# EAGLE board Hive 1.5 (EAGLE 9.6.2)
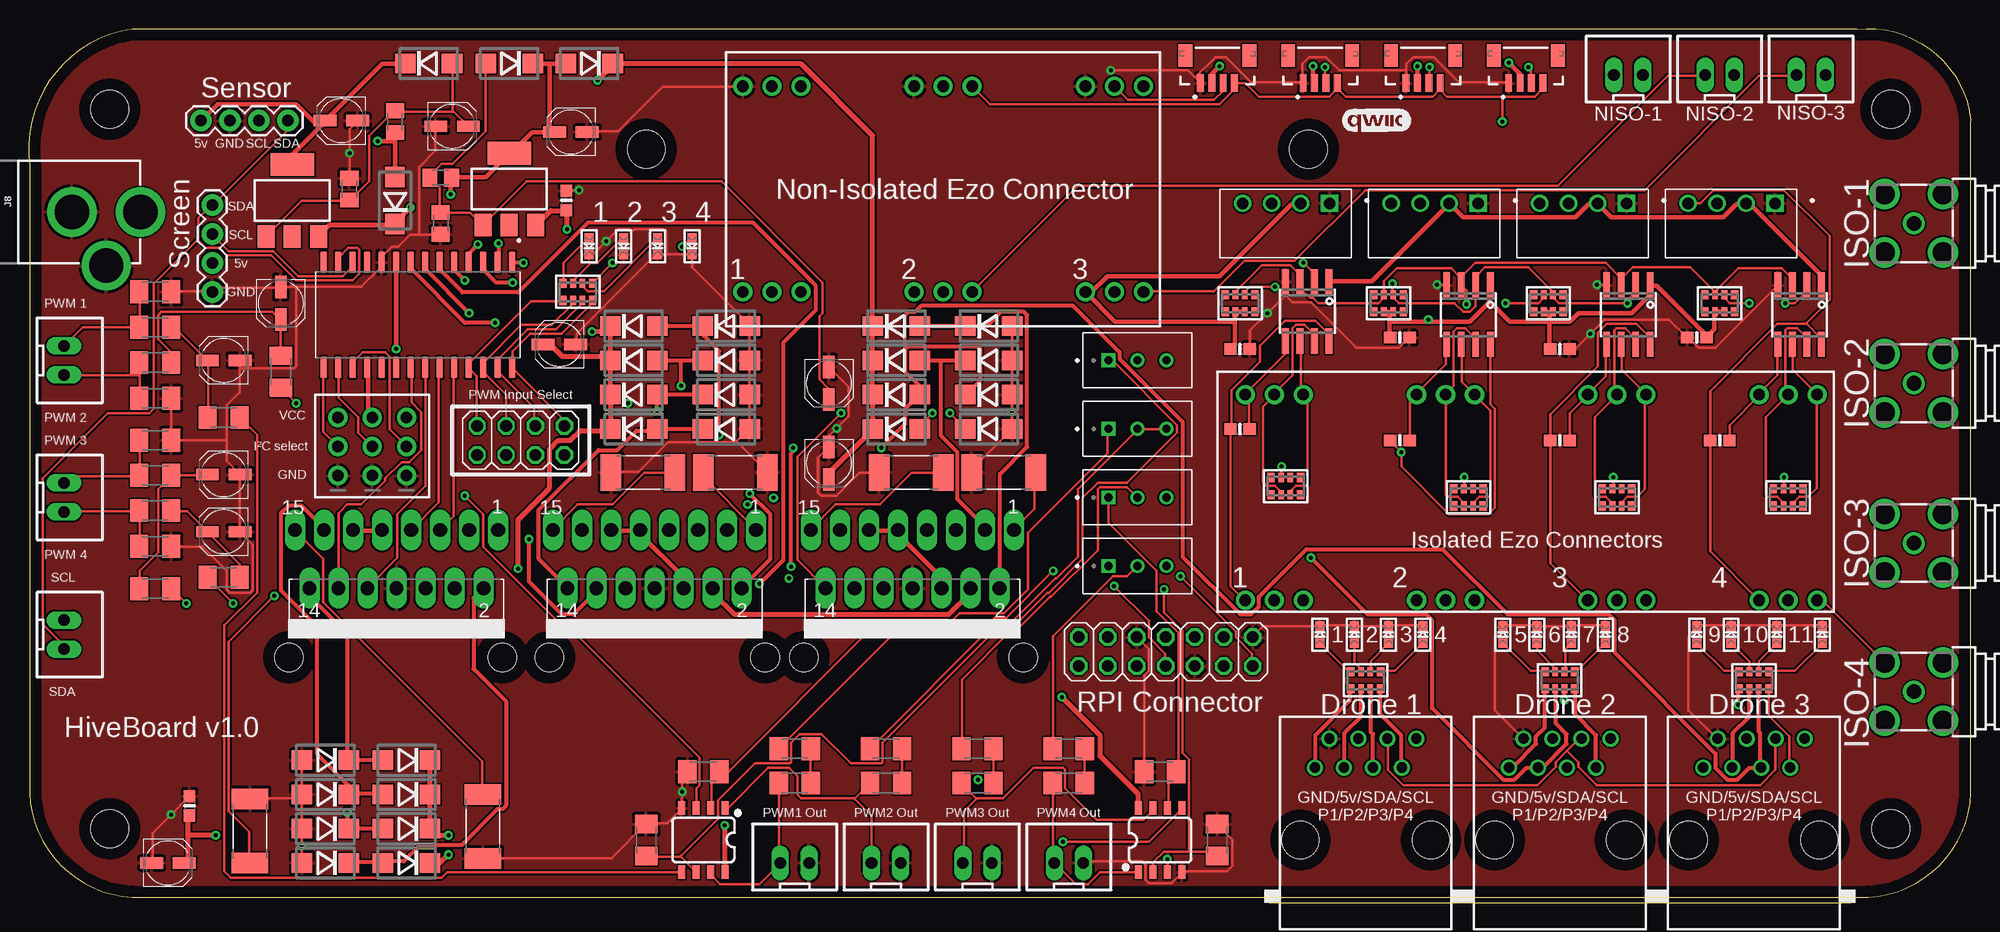
[diagram p2: board, top side]
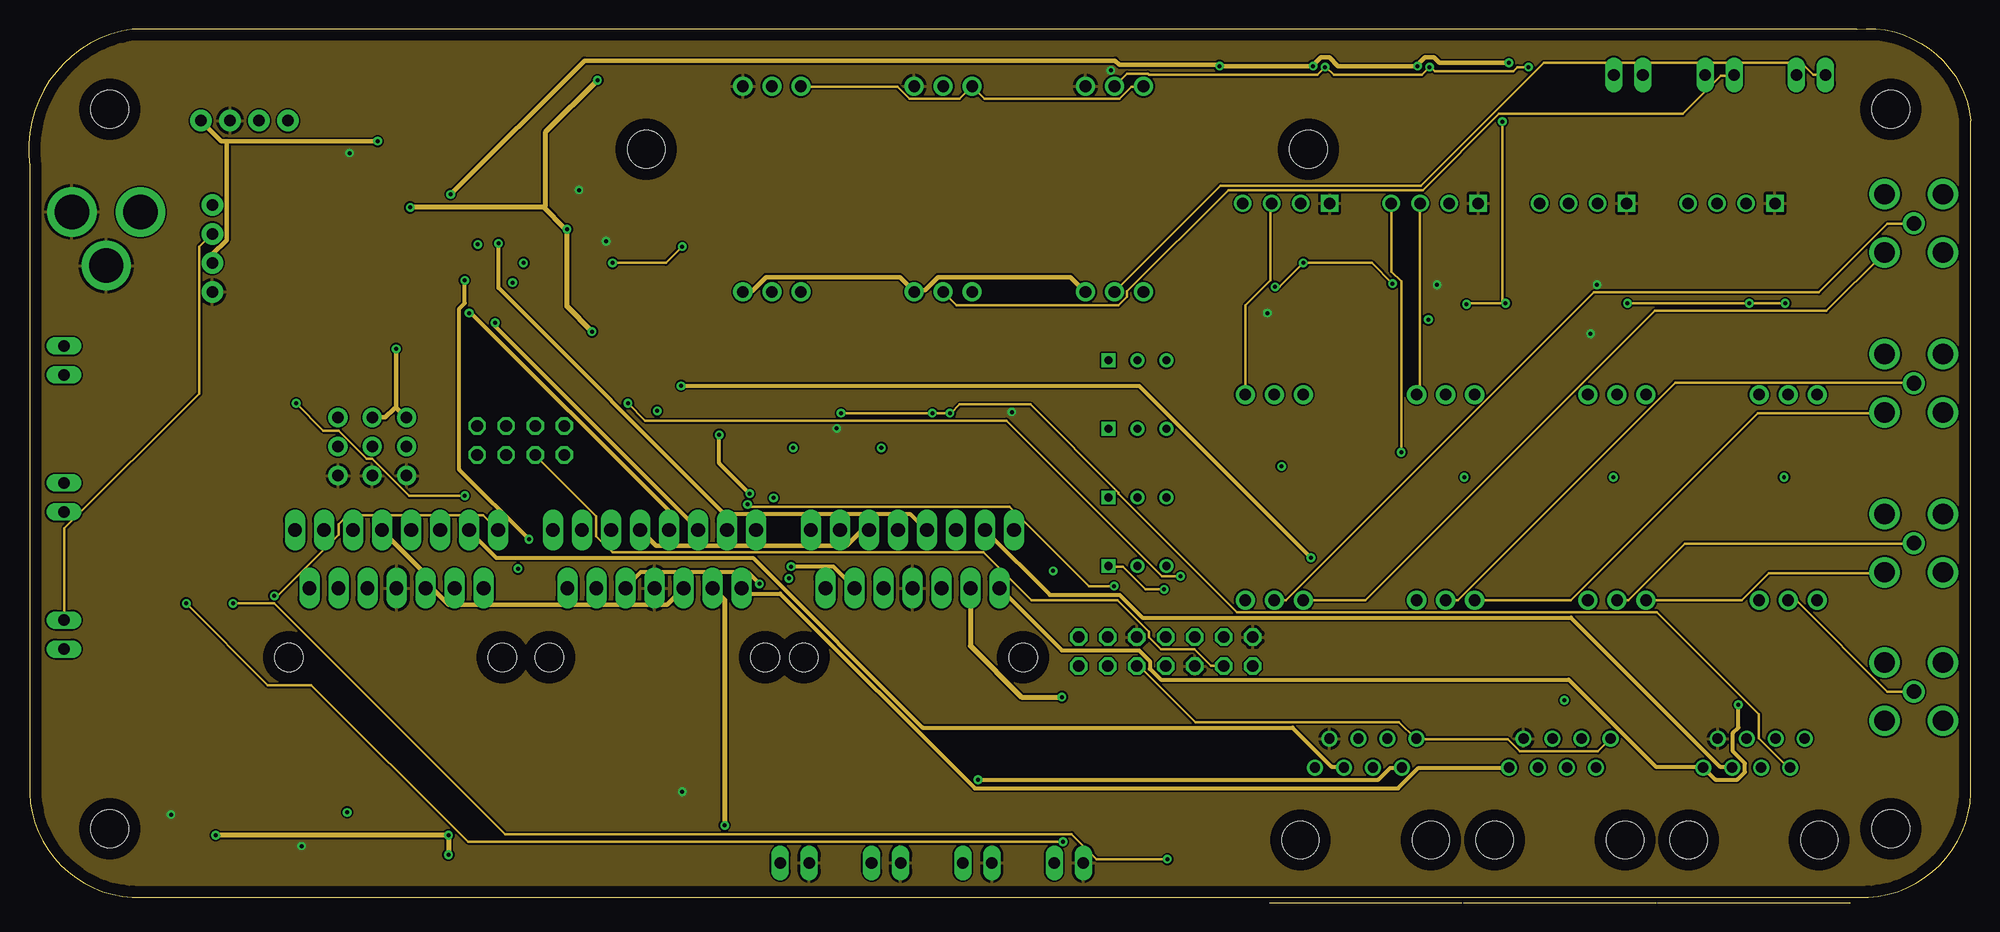
[diagram p3: board, inner layer Route2]
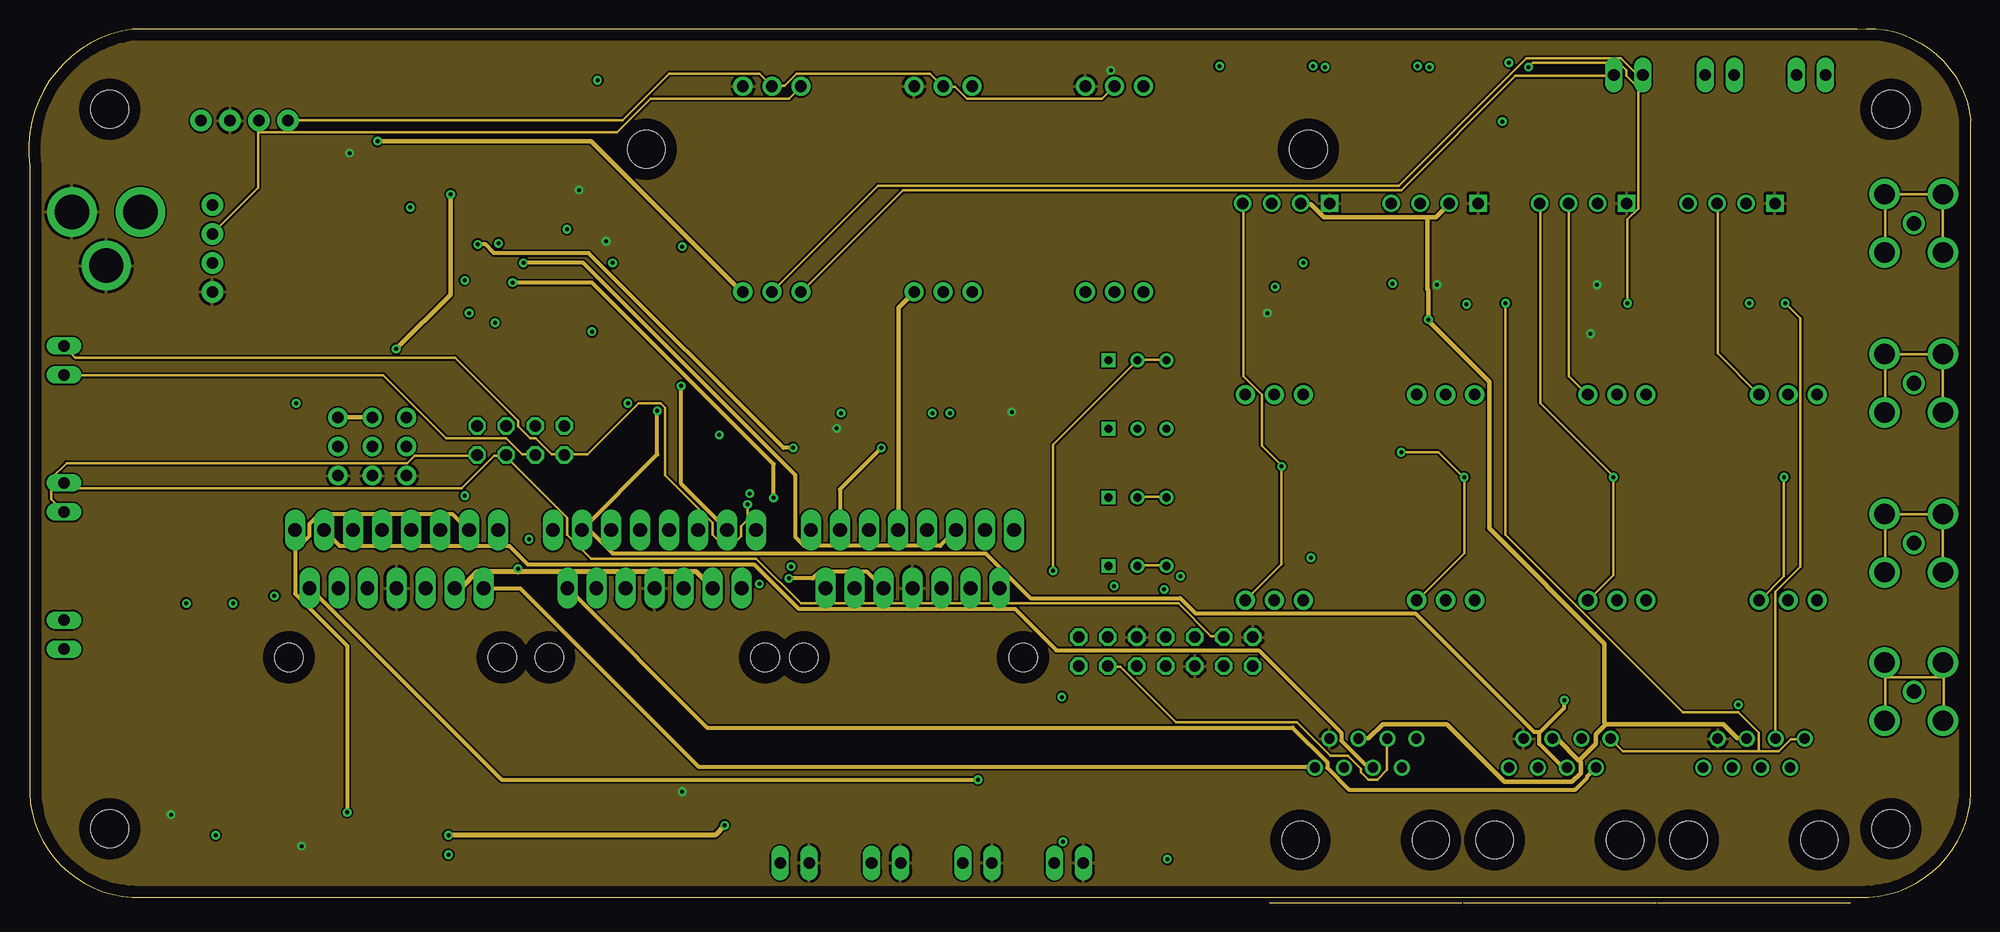
[diagram p4: board, inner layer Route15]
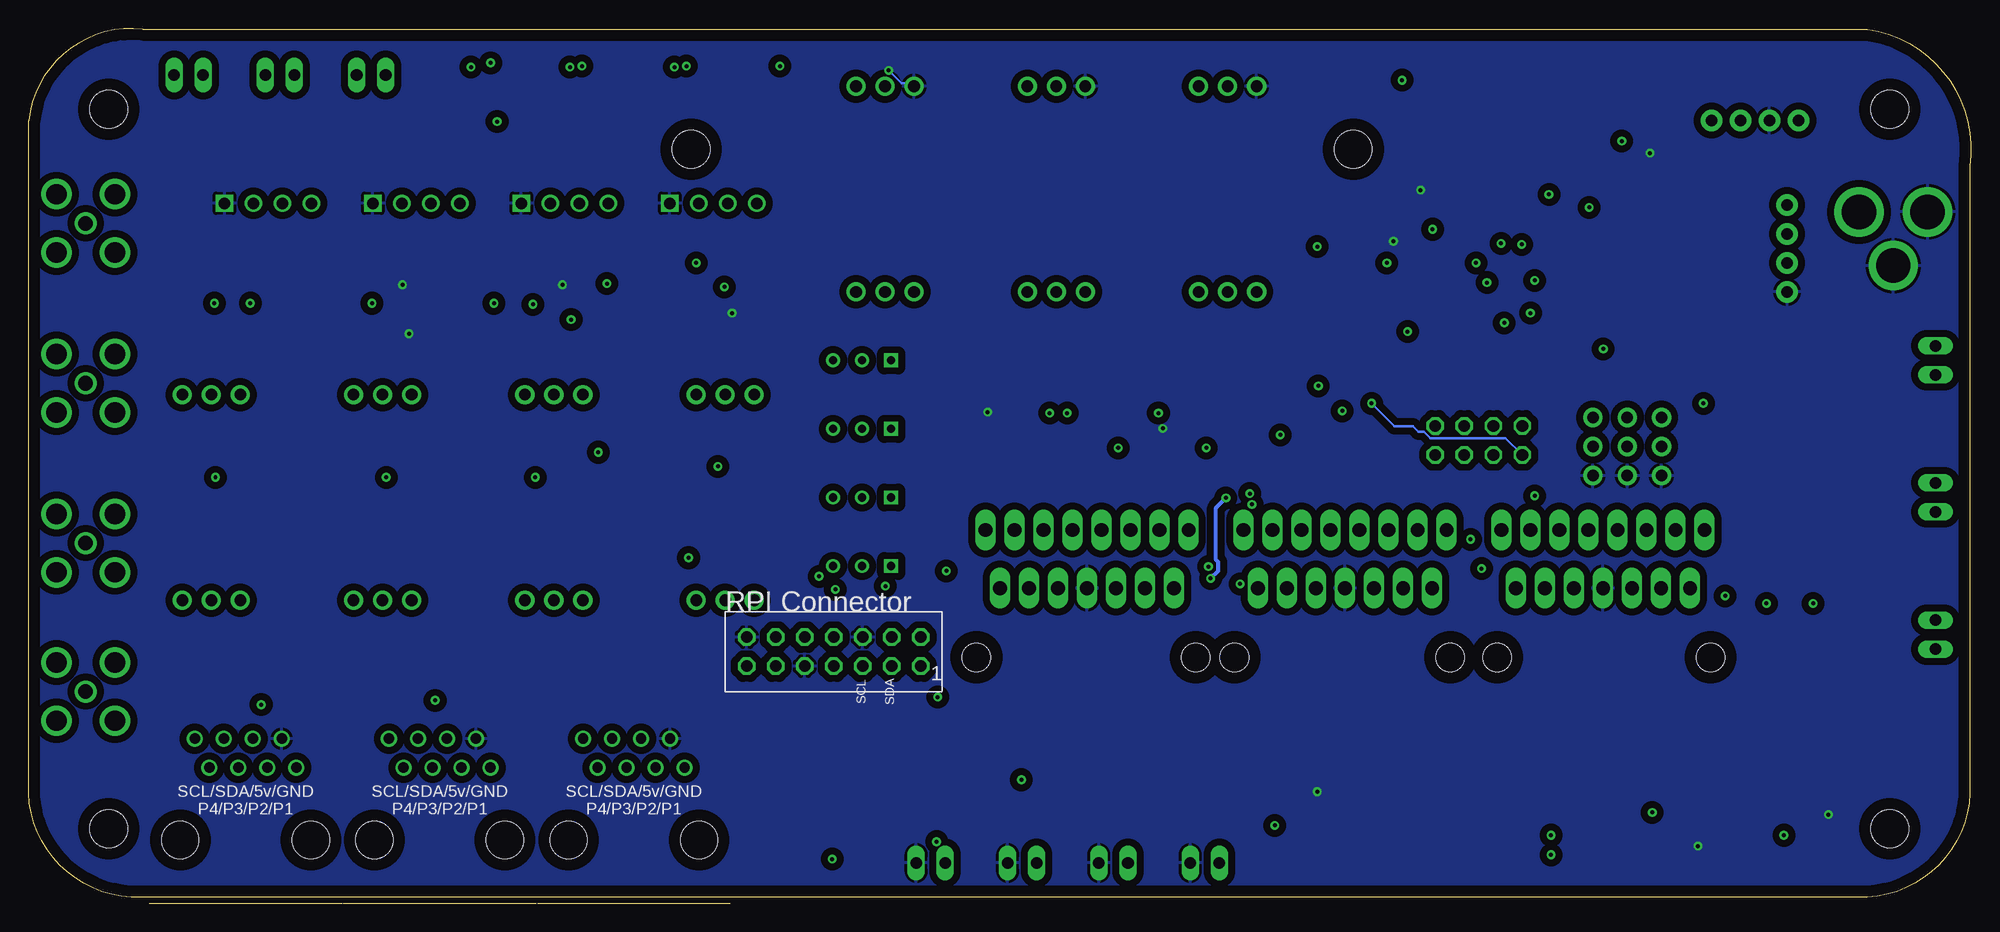
[diagram p5: board, bottom side, seen from below]

Size 170.1 x 76.05 mm. Coordinates in mm from the lower left corner, seen from the top.
Outline: 9.1,0 161.1,0 arc90 170.1,10 170.1,68 arc90 160.1,76 9.1,76 arc90 0.1,64 0.1,10 arc90 9.1,0
Copper layers (1+2*15+16): Top 0.035mm / dielectric 1.5mm / Route2 0.035mm / dielectric 0.15mm / Route15 0.035mm / dielectric 0.2mm / Bottom 0.035mm
Design rules "default *": minimum track width 6mil, minimum drill 0.35mm, track to track 6mil, track to pad 6mil, pad to pad 6mil, via to via 6mil, smd to smd 6mil, copper to edge 40mil, drill to drill 6mil, minimum pad ring 10mil, minimum via ring 8mil, stop-mask expansion 4mil, vias tented up to drill 0mil, thermal gap 10mil
Net classes: 0 default: width 0.229 mm, clearance 0.076 mm; 1 highpower: width 0.356 mm, drill 0.356 mm; 2 12v: width 0.457 mm, drill 0.102 mm, clearance 0.254 mm; 3 5v: width 0.406 mm, drill 0.102 mm, clearance 0.254 mm; 4 3.3v: width 0.406 mm, drill 0.102 mm, clearance 0.254 mm; 5 i2c: width 0.356 mm, drill 0.102 mm, clearance 0.254 mm; 6 GPIO: width 0.356 mm, drill 0.102 mm, clearance 0.254 mm; 8 New Class: drill 0.102 mm, clearance 0.152 mm
Holes 2.5 mm at 45.6,21 64.5,21 67.9,21 87.1,21 22.8,21 41.5,21

## Footprints (pad centres in the part's own frame; a part is rotated, then mirrored left to right if it is on the bottom)
UD-4X5,8_NICHICON = smd 2 x 1: + 1.425,0; - -1.425,0
0603-NO = smd 1.075 x 1: 1 -0.85,0; 2 0.85,0
DO214BA = smd 1.8 x 1.7: A 2.05,0; C -2.05,0
STAND-OFF = hole 3.302: 0,0
SOT223 = smd 1.5 x 2: 1 -2.3,-3.15; 2 0,-3.15; 3 2.3,-3.15 | smd 3.8 x 2: 4 0,3.15
MULTIWATT-15 = drill 1.2 long: 1 -8.89,-7.62; 2 -7.62,-2.54; 3 -6.35,-7.62; 4 -5.08,-2.54; 5 -3.81,-7.62; 6 -2.54,-2.54; 7 -1.27,-7.62; 8 0,-2.54; 9 1.27,-7.62; 10 2.54,-2.54; 11 3.81,-7.62; 12 5.08,-2.54; 13 6.35,-7.62; 14 7.62,-2.54; 15 8.89,-7.62
1X04 = drill 1.016 pad 1.88: 1 0,0; 2 2.54,0; 3 5.08,0; 4 7.62,0
JST04_1MM_VERT = smd 0.6 x 1.55: 1 -1.478,0.775; 2 -0.478,0.775; 3 0.522,0.775; 4 1.522,0.775 | smd 1.2 x 2: NC1 -2.778,3.2; NC2 2.822,3.2
POWER_JACK_PTH = drill 2.997 pad 4.318: GND 0,7.7; GNDBREAK 4.7,10.7; PWR 0,13.7
1X03_ROUND = drill 1 pad 1.676: 1 -2.54,0; 2 0,0; 3 2.54,0
2X04 = drill 1.016 octagon: 1 -3.81,-1.27; 2 -3.81,1.27; 3 -1.27,-1.27; 4 -1.27,1.27; 5 1.27,-1.27; 6 1.27,1.27; 7 3.81,-1.27; 8 3.81,1.27
1X03-CLEANBIG = drill 1.016 pad 1.676: 1 -2.54,0; 2 0,0; 3 2.54,0
2X07 = drill 1.016 octagon: 1 -7.62,-1.27; 2 -7.62,1.27; 3 -5.08,-1.27; 4 -5.08,1.27; 5 -2.54,-1.27; 6 -2.54,1.27; 7 0,-1.27; 8 0,1.27; 9 2.54,-1.27; 10 2.54,1.27; 11 5.08,-1.27; 12 5.08,1.27; 13 7.62,-1.27; 14 7.62,1.27
CHIPLED_0603 = smd 0.8 x 0.8: A 0,-0.75; C 0,0.75
CONV_RFM-0505S = drill 1 square: 1 -3.85,-1.75 | drill 1: 2 -1.31,-1.75; 3 1.23,-1.75; 4 3.77,-1.75
R2512 = smd 1.8 x 3.2: 1 -2.8,0; 2 2.8,0
M1206 = smd 1.6 x 2: 1 -1.4,0; 2 1.4,0
M0805 = smd 1.3 x 1.6: 1 -0.95,0; 2 0.95,0
TRIM_3296W-1-103 = drill 0.71 square: 1 -2.54,0 | drill 0.71: 2 0,0; 3 2.54,0
RESPACK_4X0603 = smd 0.65 x 0.8: 1 -1.3,-0.75; 4 1.3,-0.75; 5 1.3,0.75; 8 -1.3,0.75 | smd 0.5 x 0.8: 2 -0.4,-0.75; 3 0.4,-0.75; 6 0.4,0.75; 7 -0.4,0.75
SOIC127P1030X265-28N = smd 1.9 x 0.6: 1 -4.605,8.255; 2 -4.605,6.985; 3 -4.605,5.715; 4 -4.605,4.445; 5 -4.605,3.175; 6 -4.605,1.905; 7 -4.605,0.635; 8 -4.605,-0.635; 9 -4.605,-1.905; 10 -4.605,-3.175; 11 -4.605,-4.445; 12 -4.605,-5.715; 13 -4.605,-6.985; 14 -4.605,-8.255; 15 4.605,-8.255; 16 4.605,-6.985; 17 4.605,-5.715; 18 4.605,-4.445; 19 4.605,-3.175; 20 4.605,-1.905; 21 4.605,-0.635; 22 4.605,0.635; 23 4.605,1.905; 24 4.605,3.175; 25 4.605,4.445; 26 4.605,5.715; 27 4.605,6.985; 28 4.605,8.255
SO08 = smd 0.6 x 1.2: 1 -1.905,-2.8; 2 -0.635,-2.8; 3 0.635,-2.8; 4 1.905,-2.8; 5 1.905,2.8; 6 0.635,2.8; 7 -0.635,2.8; 8 -1.905,2.8
JST-XH-02-PACKAGE-LONG-PAD = drill 1.016 long: 1 -1.27,0; 2 1.27,0
SOIC8_150MIL = smd 0.6 x 2.2: 1 -1.905,-2.6; 2 -0.635,-2.6; 3 0.635,-2.6; 4 1.905,-2.6; 5 1.905,2.6; 6 0.635,2.6; 7 -0.635,2.6; 8 -1.905,2.6
RJ45-NO-SHIELD = drill 0.9 pad 1.4: 1 -4.445,6.35; 2 -3.175,8.89; 3 -1.905,6.35; 4 -0.635,8.89; 5 0.635,6.35; 6 1.905,8.89; 7 3.175,6.35; 8 4.445,8.89 | hole 3.251: -5.715,0; 5.715,0
BU-SMA-G = drill 1.27: 1 0,0 | drill 1.778: 2 -2.55,2.55; 3 2.55,2.55; 4 2.55,-2.55; 5 -2.55,-2.55

## Placement (x,y rotation side)
C1  100nF  [UD-4X5,8_NICHICON]  12.2,3 0 top
C1A1  1uf 50v  [UD-4X5,8_NICHICON]  17.1,47 180 top
C1A2  1uf 50v  [UD-4X5,8_NICHICON]  17.1,37 180 top
C1B1  1uf 50v  [UD-4X5,8_NICHICON]  22.1,52 270 top
C1B2  1uf 50v  [UD-4X5,8_NICHICON]  17.1,32 180 top
C2  0.1uF  [0603-NO]  14.1,8 270 top
C3  1uF 50v  [UD-4X5,8_NICHICON]  27.4,68 180 top
C4  10uF 35v  [UD-4X5,8_NICHICON]  37.1,67.5 0 top
C5  1uf 50v  [UD-4X5,8_NICHICON]  47.5,67 180 top
C6  0.1uF  [0603-NO]  47.1,61 270 top
C7  100nF  [UD-4X5,8_NICHICON]  46.5,48.4 180 top
C8  10uF 35v  [UD-4X5,8_NICHICON]  70.1,45 270 top
C9  100nF  [UD-4X5,8_NICHICON]  70.1,38 270 top
C10  0.1uF  [0603-NO]  106.1,48 0 top
C11  0.1uF  [0603-NO]  106.1,41 0 top
C12  0.1uF  [0603-NO]  120.1,49 0 top
C13  0.1uF  [0603-NO]  120.1,40 0 top
C14  0.1uF  [0603-NO]  134.1,48 0 top
C15  0.1uF  [0603-NO]  134.1,40 0 top
C16  0.1uF  [0603-NO]  146.1,49 180 top
C17  0.1uF  [0603-NO]  148.1,40 0 top
D1  1N4002  [DO214BA]  35.05,73 0 top
D2  1N4002  [DO214BA]  32.1,61 90 top
D3  1N4004  [DO214BA]  33.1,3 180 top
D4  1N4004  [DO214BA]  26,3 180 top
D5  1N4004  [DO214BA]  33.1,6 180 top
D6  1N4004  [DO214BA]  26,6 180 top
D7  1N4004  [DO214BA]  33.1,9 180 top
D8  1N4004  [DO214BA]  26,9 180 top
D9  1N4004  [DO214BA]  33.1,12 180 top
D10  1N4004  [DO214BA]  26,12 180 top
D11  1N4004  [DO214BA]  42.1,73 180 top
D12  1N4004  [DO214BA]  49.1,73 180 top
D13  1N4004  [DO214BA]  53,50 0 top
D14  1N4004  [DO214BA]  53,47 0 top
D15  1N4004  [DO214BA]  53,44 0 top
D16  1N4004  [DO214BA]  53,41 0 top
D17  1N4004  [DO214BA]  61.1,50 0 top
D18  1N4004  [DO214BA]  61.1,47 0 top
D19  1N4004  [DO214BA]  61.1,44 0 top
D20  1N4004  [DO214BA]  61.1,41 0 top
D21  1N4004  [DO214BA]  76,50 0 top
D22  1N4004  [DO214BA]  84.1,50 0 top
D23  1N4004  [DO214BA]  76,47 0 top
D24  1N4004  [DO214BA]  84.1,47 0 top
D25  1N4004  [DO214BA]  76,44 0 top
D26  1N4004  [DO214BA]  84.1,44 0 top
D27  1N4004  [DO214BA]  76,41 0 top
D28  1N4004  [DO214BA]  84.1,41 0 top
H1  STAND-OFF  [STAND-OFF]  7.1,69 0 top
H2  STAND-OFF  [STAND-OFF]  7.1,6 0 top
H3  STAND-OFF  [STAND-OFF]  163.1,69 0 top
H4  STAND-OFF  [STAND-OFF]  163.1,6 0 top
IC1  LM317MBSTT3  [SOT223]  23.1,61 0 top
IC2  L298  [MULTIWATT-15]  32.23,24.52 180 top
IC3  LM317MBSTT3  [SOT223]  42.1,62 0 top
IC4  L298  [MULTIWATT-15]  54.82,24.52 180 top
IC5  L298  [MULTIWATT-15]  77.41,24.52 180 top
J2  C2886705  [1X04]  15.1,68 0 top
J3  C2886705  [1X04]  16.1,53 90 top
J4  Vertical Qwiic Connector  [JST04_1MM_VERT]  104.1,70.5 0 top
J5  Vertical Qwiic Connector  [JST04_1MM_VERT]  113.1,70.5 0 top
J6  Vertical Qwiic Connector  [JST04_1MM_VERT]  122.1,70.5 0 top
J7  Vertical Qwiic Connector  [JST04_1MM_VERT]  131.1,70.5 0 top
J8  POWER_JACK  [POWER_JACK_PTH]  -3.9,60 270 top
JP1  [1X03_ROUND]  27.1,39.46 90 top
JP2  [1X03_ROUND]  30.1,39.46 90 top
JP3  [1X03_ROUND]  33.1,39.46 90 top
JP4  [2X04]  43.1,40 0 top
JP5  C2886705  [1X03-CLEANBIG]  65.1,71 180 top
JP6  C2886705  [1X03-CLEANBIG]  65.1,53 0 top
JP7  C2886705  [1X03-CLEANBIG]  80.1,71 180 top
JP8  C2886705  [1X03-CLEANBIG]  80.1,53 0 top
JP9  C2886705  [1X03-CLEANBIG]  95.1,71 180 top
JP10  C2886705  [1X03-CLEANBIG]  95.1,53 0 top
JP11  [2X07]  99.6,21.5 0 top
JP12  C2886705  [1X03-CLEANBIG]  109.1,44 180 top
JP13  C2886705  [1X03-CLEANBIG]  109.1,26 0 top
JP14  C2886705  [1X03-CLEANBIG]  124.1,44 180 top
JP15  C2886705  [1X03-CLEANBIG]  124.1,26 0 top
JP16  C2886705  [1X03-CLEANBIG]  139.1,44 180 top
JP17  C2886705  [1X03-CLEANBIG]  139.1,26 0 top
JP18  C2886705  [1X03-CLEANBIG]  154.1,44 180 top
JP19  C2886705  [1X03-CLEANBIG]  154.1,26 0 top
LED1  [CHIPLED_0603]  49.1,57 180 top
LED2  [CHIPLED_0603]  52.1,57 180 top
LED3  [CHIPLED_0603]  55.1,57 180 top
LED4  [CHIPLED_0603]  58.1,57 180 top
LED5  [CHIPLED_0603]  113.1,23 0 top
LED6  [CHIPLED_0603]  116.1,23 0 top
LED7  [CHIPLED_0603]  119.1,23 0 top
LED8  [CHIPLED_0603]  122.1,23 0 top
LED9  [CHIPLED_0603]  129.1,23 0 top
LED10  [CHIPLED_0603]  132.1,23 0 top
LED11  [CHIPLED_0603]  135.1,23 0 top
LED12  [CHIPLED_0603]  138.1,23 0 top
LED13  [CHIPLED_0603]  146.1,23 0 top
LED14  [CHIPLED_0603]  149.1,23 0 top
LED15  [CHIPLED_0603]  153.1,23 0 top
LED16  [CHIPLED_0603]  157.1,23 0 top
PS1  RFM-0505S  [CONV_RFM-0505S]  110.1,59 180 top
PS2  RFM-0505S  [CONV_RFM-0505S]  123.1,59 180 top
PS3  RFM-0505S  [CONV_RFM-0505S]  136.1,59 180 top
PS4  RFM-0505S  [CONV_RFM-0505S]  149.1,59 180 top
R1  0,5 x 2W  [R2512]  19.4,5.8 270 top
R1A1  100kΩ  [M1206]  11.1,49.91 180 top
R1A2  100kΩ  [M1206]  11.1,36.93 180 top
R1B1  100kΩ  [M1206]  11.1,46.81 0 top
R1B2  100kΩ  [M1206]  11.1,33.86 0 top
R2  240Ω  [M0805]  32.1,67.9 270 top
R2A1  100kΩ  [M1206]  54.1,5 270 top
R2A2  100kΩ  [M1206]  99.1,11 0 top
R2B1  100kΩ  [M1206]  59.1,11 180 top
R2B2  100kΩ  [M1206]  104.1,5 90 top
R3  240Ω  [M0805]  36.1,63 0 top
R3-1A1  3296W-1-103  [TRIM_3296W-1-103]  97.1,47 0 top
R3-1A2  3296W-1-103  [TRIM_3296W-1-103]  97.1,35 0 top
R3-1B1  3296W-1-103  [TRIM_3296W-1-103]  97.1,41 0 top
R3-1B2  3296W-1-103  [TRIM_3296W-1-103]  97.1,29 0 top
R3-2A1  180KΩ  [M1206]  67.1,13 0 top
R3-2A2  180KΩ  [M1206]  83.1,13 0 top
R3-2B1  180KΩ  [M1206]  75.1,13 0 top
R3-2B2  180KΩ  [M1206]  91.1,13 0 top
R3-3A1  15kΩ  [M1206]  67.1,10 180 top
R3-3A2  15kΩ  [M1206]  83.1,10 180 top
R3-3B1  15kΩ  [M1206]  75.1,10 180 top
R3-3B2  15kΩ  [M1206]  91.1,10 180 top
R4  720Ω  [M0805]  28.1,62 270 top
R4A1  75kΩ  [M1206]  11.1,27 0 top
R4A2  75kΩ  [M1206]  17.1,42 0 top
R4B1  75kΩ  [M1206]  22.1,46 270 top
R4B2  75kΩ  [M1206]  17.1,28 180 top
R5  394Ω  [M0805]  36.1,59 90 top
R5A1  10kΩ  [M1206]  11.1,53 0 top
R5A2  10kΩ  [M1206]  11.1,40 0 top
R5B1  10kΩ  [M1206]  11.1,43.69 0 top
R5B2  10kΩ  [M1206]  11.1,30.73 0 top
R6  0,5 x 2W  [R2512]  39.8,6.2 90 top
R7  10kΩ  [RESPACK_4X0603]  48.1,53 0 top
R8  0,5 x 2W  [R2512]  53.8,37.2 0 top
R9  0,5 x 2W  [R2512]  61.9,37.2 180 top
R10  0,5 x 2W  [R2512]  77.3,37.2 0 top
R11  0,5 x 2W  [R2512]  85.4,37.2 0 top
R12  10KΩ  [RESPACK_4X0603]  106.1,52 180 top
R13  10KΩ  [RESPACK_4X0603]  119.1,52 180 top
R14  10KΩ  [RESPACK_4X0603]  110.1,36 0 top
R15  10kΩ  [RESPACK_4X0603]  117.1,19 0 top
R16  10KΩ  [RESPACK_4X0603]  126.1,35 0 top
R17  10KΩ  [RESPACK_4X0603]  133.1,52 180 top
R18  10KΩ  [RESPACK_4X0603]  139.1,35 0 top
R19  10kΩ  [RESPACK_4X0603]  134.1,19 0 top
R20  10KΩ  [RESPACK_4X0603]  148.1,52 180 top
R21  10KΩ  [RESPACK_4X0603]  154.1,35 0 top
R22  10kΩ  [RESPACK_4X0603]  151.1,19 0 top
U1  MCP23017-E/SO  [SOIC127P1030X265-28N]  34.1,51 270 top
U2  LM358  [SO08]  59.1,5 180 top
U3  LM358  [SO08]  99.1,5 0 top
U$1  [STAND-OFF]  54.1,65.5 0 top
U$2  [QWIIC_6MM]  118.1,68 0 top
U$4  [STAND-OFF]  112.1,65.5 0 top
X1  PWM-IN  [JST-XH-02-PACKAGE-LONG-PAD]  3.1,47 270 top
X2  PWM-IN  [JST-XH-02-PACKAGE-LONG-PAD]  3.1,35 270 top
X3  jst-xh-2  [JST-XH-02-PACKAGE-LONG-PAD]  3.1,23 270 top
X4  PWM1  [JST-XH-02-PACKAGE-LONG-PAD]  67.1,3 0 top
X5  PWM2  [JST-XH-02-PACKAGE-LONG-PAD]  75.1,3 0 top
X6  PWM3  [JST-XH-02-PACKAGE-LONG-PAD]  83.1,3 0 top
X7  PWM2  [JST-XH-02-PACKAGE-LONG-PAD]  91.1,3 0 top
X8  ISO154X  [SOIC8_150MIL]  111.99,51.3 180 top
X9  RJ45-6L-B  [RJ45-NO-SHIELD]  117.1,5 0 top
X10  ISO154X  [SOIC8_150MIL]  126.1,51 180 top
X11  jst-xh-2  [JST-XH-02-PACKAGE-LONG-PAD]  140.1,72 0 top
X12  ISO154X  [SOIC8_150MIL]  140.1,51 180 top
X13  RJ45-6L-B  [RJ45-NO-SHIELD]  134.1,5 0 top
X14  jst-xh-2  [JST-XH-02-PACKAGE-LONG-PAD]  148.1,72 0 top
X15  ISO154X  [SOIC8_150MIL]  155.1,51 180 top
X16  RJ45-6L-B  [RJ45-NO-SHIELD]  151.1,5 0 top
X17  jst-xh-2  [JST-XH-02-PACKAGE-LONG-PAD]  156.1,72 0 top
X18  BU-SMA-G  [BU-SMA-G]  165.1,59 0 top
X19  BU-SMA-G  [BU-SMA-G]  165.1,45 0 top
X20  BU-SMA-G  [BU-SMA-G]  165.1,31 0 top
X21  BU-SMA-G  [BU-SMA-G]  165.1,18 0 top

## Tracks (layer width: path | path; a pad name or v marks a point on that pad's centre or on a via)
+3.3V  (via drill 0.35)
  Top 0.406: v104.3,72.77 103.63,72.1 103.63,71.34 J4.2 | v112.49,72.77 112.49,71.44 112.59,71.34 J5.2 | v121.64,72.77 121.64,71.34 J6.2 | v129.64,73.06 130.59,72.1 130.59,71.34 J7.2 | 45.63,72.96 46.96,72.96 D12.A | 45.63,72.96 44.2,72.96 D11.C | 45.63,72.96 45.63,67.15 C5.+ 46.01,66.96 44.1,66.96 42.29,65.15 IC3.4 42.01,65.06 40.01,63.06 37.05,63.06 R3.2 36.96,62.87 v36.96,61.53 | U1.18 29.72,46.39 29.72,42.29 30.01,42.01 JP2.3 | v32.2,48.01 32.2,55.53 U1.9
  Route2 0.406: v129.64,73.06 123.54,73.06 123.06,73.53 122.3,73.53 121.73,72.96 v121.64,72.77 114.68,72.77 113.92,73.53 113.16,73.53 112.59,72.96 v112.49,72.77 v104.3,72.77 104.11,72.87 95.54,72.87 95.16,73.25 48.67,73.25 v36.96,61.53 | 32.2,42.86 v32.2,48.01 | 32.2,42.86 33.05,42.01 JP3.3 | JP2.3 31.24,42.01 32.01,42.77 32.2,42.86
  Route15 0.406: JP1.3 27.15,42.01 30.01,42.01 JP2.3 | v36.96,61.53 36.96,52.77 v32.2,48.01
+5V  (via drill 0.35)
  Top 0.406: R20.7 147.73,51.24 R20.6 147.64,51.05 147.64,49.72 146.97,49.05 C16.1 146.88,49.24 142.59,53.53 142.02,53.53 X12.1 141.92,53.34 141.92,52.67 140.4,51.15 135.73,51.15 134.97,50.39 133.16,50.39 | 133.16,51.24 133.45,51.24 R17.7 | 133.16,51.24 132.78,51.24 R17.6 | 133.16,50.39 133.16,48.01 C14.1 | 133.16,50.39 133.16,51.24 | 119.16,51.24 119.44,51.24 R13.7 | 119.16,51.24 118.78,51.24 R13.6 | 119.16,50.39 119.16,49.05 C12.1 | 119.16,50.39 119.16,51.24 | 122.59,50.39 126.21,50.39 127.92,52.1 | 122.59,50.39 119.16,50.39 | 127.92,52.1 127.92,53.53 X10.1 | 133.16,50.39 129.73,50.39 128.11,52.01 127.92,52.1 | X15.1 156.97,53.63 156.97,54.48 150.78,60.67 150.5,60.67 PS4.2 150.21,60.67 149.54,60.67 148.4,59.53 138.59,59.53 137.54,60.58 PS3.2 137.35,60.67 136.59,60.67 135.45,59.53 125.64,59.53 124.59,60.58 PS2.2 124.4,60.67 117.63,53.91 113.92,53.91 X8.1 | v122.59,50.58 122.59,50.39 | IC5.11 73.63,32.1 76.11,32.1 IC5.9 76.01,31.91 79.92,28 79.92,27.15 IC5.6 | IC2.11 28.48,32.1 30.86,32.1 IC2.9 | IC4.11 51.06,32.1 53.53,32.1 IC4.9 53.44,31.91 57.34,28 57.34,27.15 IC4.6 | D1.C 32.96,72.96 30.96,72.96 26,68.01 C3.+ | IC1.4 23.15,64.2 23.15,65.06 25.91,67.82 C3.+ | 32.1,66.2 D2.A | 32.1,66.2 32.1,66.86 R2.2 | v30.58,66.2 32.1,66.2 | C3.+ 25.34,67.53 23.43,69.44 16.57,69.44 15.15,68.01 J2.1 | R12.7 105.73,51.24 R12.6 105.63,51.05 105.63,50.39 | 105.63,50.39 105.63,48.39 C10.1 | 105.63,50.39 95.16,50.39 92.58,52.96 JP10.1 92.97,52.86 94.49,54.39 104.3,54.39 110.59,60.67 111.35,60.67 PS1.2
  Route2 0.406: IC2.9 30.96,32.1 34.67,28.38 34.67,27.15 IC2.6 34.96,27.05 35.34,27.05 36.77,25.62 55.91,25.62 57.34,27.05 IC4.6 | IC5.11 73.53,32.1 72.96,32.1 71.63,30.77 54.96,30.77 53.63,32.1 IC4.9 | 17.34,66.2 16.86,66.2 15.15,67.91 J2.1 | 17.34,66.2 v30.58,66.2 | 17.34,66.2 17.34,57.53 16.1,56.29 16.1,55.63 J3.2 | JP6.1 62.58,53.05 63.34,53.05 64.58,54.29 76.3,54.29 77.53,53.05 JP8.1 77.73,53.15 78.49,53.15 79.63,54.29 91.25,54.29 92.49,53.05 JP10.1
  Route15 0.406: 135.78,11.95 133.92,13.81 133.54,13.81 X13.4 | 135.78,11.95 135.92,11.81 135.92,10.86 135.16,10.1 129.26,10.1 124.21,15.14 118.59,15.14 117.35,13.91 116.49,13.91 X9.4 | 138.11,15.14 148.4,15.14 149.64,13.91 150.4,13.91 X16.4 | 138.11,15.14 137.26,14.29 137.26,13.43 135.78,11.95 | 122.49,59.53 123.25,59.53 124.4,60.67 PS2.2 | 122.49,59.53 113.44,59.53 112.3,60.67 111.44,60.67 PS1.2 | 122.49,59.53 122.49,53.24 122.59,53.15 v122.59,50.58 122.68,50.39 127.92,45.15 127.92,32.29 138.02,22.19 138.02,15.34 138.11,15.14 | v30.58,66.2 49.25,66.2 62.49,52.96 JP6.1 | IC5.9 76.2,32.19 76.2,51.63 77.53,52.96 JP8.1
+12V  (via drill 0.35)
  Top 0.457: IC1.3 25.43,57.91 26.39,58.86 32.01,58.86 D2.C 32.2,59.15 v33.43,60.39 | IC3.3 44.48,58.86 45.72,60.1 47.05,60.1 C6.2 47.15,59.91 v47.15,58.48 | D14.C 50.96,46.96 50.96,44.2 D15.C 50.96,43.91 50.96,41.05 D16.C 50.77,40.86 48.29,40.86 47.44,40.01 46.39,40.01 45.63,39.24 45.63,35.81 42.86,33.05 v42.86,28.77 | D14.C 50.96,47.24 50.96,49.91 D13.C 50.77,49.53 v49.34,49.53 | C7.+ 45.15,48.39 45.72,48.39 46.77,47.34 50.77,47.34 D14.C | C9.+ 70.11,37.15 73.82,40.86 D27.C 73.92,41.05 73.92,43.91 D25.C 73.92,44.2 73.92,46.96 D23.C 73.92,47.15 73.92,49.91 D21.C 73.92,50.2 73.92,66.67 67.63,72.96 51.15,72.96 D12.C 51.06,72.77 v49.82,71.53 | v90.49,17.53 93.82,14.19 93.82,12.38 97.16,9.05 97.16,7.81 U3.8 | 14,5.43 14,3.43 13.62,3.05 C1.+ | 14,5.43 14,7.14 C2.2 | v36.77,3.71 36.1,3.05 35.15,3.05 D3.C | v36.77,5.43 35.62,5.43 35.15,5.91 D5.C 35.15,6.19 35.15,8.95 D7.C 35.15,9.14 35.15,11.91 D9.C | v16.38,5.43 14,5.43 | v60.96,6.29 60.96,2.29 U2.8 | IC5.4 82.39,27.05 82.39,26.57 80.58,24.77 61.82,24.77 59.91,26.67 59.91,27.05 IC4.4
  Route2 0.457: v49.34,49.53 47.15,51.72 v47.15,58.48 46.96,58.58 45.15,60.39 | 45.15,60.39 v33.43,60.39 | v49.82,71.53 45.24,66.96 45.24,60.58 45.15,60.39 | v90.49,17.53 86.96,17.53 82.49,22 IC5.4 | v36.77,3.71 v36.77,5.43 v16.38,5.43 | v60.96,6.29 60.96,26 59.91,27.05 IC4.4
  Route15 0.457: 42.86,28.48 58.48,28.48 59.82,27.15 IC4.4 | 42.86,28.48 39.24,28.48 37.91,27.15 37.34,27.15 IC2.4 | v36.77,5.43 60.1,5.43 v60.96,6.29 | v42.86,28.77 42.86,28.48
GND  (via drill 0.35)
  Top 0.229: 55.82,56.29 58.01,56.29 LED4.C 58.1,56.2 58.1,55.15 63.15,50.1 D17.A 63.15,49.91 63.15,47.05 D18.A 63.15,46.96 63.15,44.1 D19.A 63.15,43.91 63.15,41.05 D20.A 63.06,40.96 62.01,39.91 | 55.82,56.29 55.15,56.29 LED3.C 55.06,56.2 54.87,56.2 48.01,49.34 48.01,48.48 C7.- | 52.77,58.29 52.58,58.48 51.63,58.48 v50.58,57.44 49.44,56.29 49.15,56.29 LED1.C | 52.77,58.29 52.77,56.96 52.1,56.29 LED2.C | 55.82,56.29 55.82,58.29 55.63,58.48 53.06,58.48 52.87,58.29 52.77,58.29 | 62.01,39.91 61.91,39.81 56.01,39.81 53.44,37.24 51.06,37.24 R8.1 | 62.01,39.91 64.68,37.24 R9.1 | R2B1.2 57.63,10.95 57.25,10.57 v57.25,9.24 57.25,7.81 U2.4 57.15,7.71 55.91,6.48 54.1,6.48 R2A1.1 54.01,6.38 51.06,3.43 39.82,3.43 R6.1 | R5B1.2 12.48,43.62 12.48,40.01 R5A2.2 12.57,40.01 17.34,40.01 | R5B2.2 12.57,30.67 15.24,30.67 17.34,28.57 17.34,26.96 17.62,26.67 19.43,26.67 19.62,26.86 19.62,30.86 18.58,31.91 C1B2.- 18.48,32.1 18.48,36.96 C1A2.- 18.48,37.05 17.34,38.2 17.34,40.01 | 18.48,46.29 18.48,44.2 17.34,43.05 17.34,40.01 | 18.48,46.29 18.48,46.96 C1A1.- | C14.2 134.97,48.01 135.45,48.01 v136.78,49.34 138.02,50.58 143.64,50.58 145.16,49.05 C16.2 145.35,48.96 146.21,48.1 147.73,48.1 153.16,53.53 X15.4 | 110.01,52.67 v108.49,51.15 106.97,49.62 106.97,48.01 C10.2 | 110.01,52.67 110.01,53.82 X8.4 | C12.2 120.87,48.96 120.02,48.1 116.3,48.1 112.3,52.1 110.68,52.1 110.11,52.67 110.01,52.67 | D22.A 86.11,49.91 86.11,47.05 D24.A 86.11,46.96 86.11,44.1 D26.A 86.11,43.91 v86.11,42.48 86.11,41.05 D28.A 86.11,40.96 82.68,37.53 82.68,37.24 R11.1 | 34.2,58.01 33.43,58.01 32.39,56.96 31.81,56.96 30.96,56.1 30.96,55.63 U1.10 30.86,55.53 30.86,55.15 29.15,53.44 23.43,53.44
  Top 0.229: 34.2,58.01 36.01,58.01 R5.1 | 34.2,58.01 34.2,63.91 35.62,65.34 35.62,67.44 C4.- | C8.- 70.11,46.39 71.82,44.67 71.82,42.1 v70.77,41.05 70.11,40.39 70.11,39.43 C9.- 70.01,39.34 69.15,38.48 69.15,35.43 69.44,35.15 70.77,35.15 72.77,37.15 74.49,37.15 R10.1 | D4.A 23.91,3.05 v23.91,4.48 23.91,5.91 D6.A 23.91,6.1 23.91,8.95 D8.A | D10.A 23.91,11.91 23.91,9.05 D8.A | R1.1 19.43,8.67 23.81,8.67 D8.A | 120.68,72.39 120.68,72.96 121.25,73.53 123.06,73.53 125.26,71.34 129.54,71.34 J7.1 | 120.68,72.39 120.68,71.34 J6.1 | C2.1 14,8.76 v12.48,7.24 10.86,5.62 10.86,3.05 C1.- | LED16.C 157.07,23.81 153.16,23.81 LED15.C 153.07,23.81 149.16,23.81 LED14.C 149.07,23.81 146.11,23.81 LED13.C 146.02,23.72 146.02,23.43 145.35,22.77 145.35,16.38 147.83,13.91 X16.2 | R2B2.2 104.11,6.38 105.44,5.05 105.44,2.76 104.97,2.29 101.06,2.29 U3.4 100.97,2.1 100.11,1.24 98.11,1.24 97.82,1.52 97.82,2.86 97.54,3.14 92.49,3.14 92.39,3.05 X7.2 | LED12.C 138.02,23.81 135.16,23.81 LED11.C 135.07,23.72 132.21,23.72 LED10.C 132.02,23.81 129.16,23.81 LED9.C 129.07,23.72 129.07,23.43 128.4,22.77 128.4,16.38 130.87,13.91 X13.2 | LED8.C 122.02,23.81 119.16,23.81 LED7.C 119.06,23.72 116.21,23.72 LED6.C 116.02,23.81 113.16,23.81 LED5.C 113.06,23.72 108.11,23.72 107.25,22.86 JP11.14 | R4.1 v28.1,65.15 28.1,67.25 28.77,67.91 C3.- | v48.2,61.91 47.15,61.91 C6.1 | v94.77,72.39 101.54,72.39 102.16,71.77 | 102.16,71.77 102.59,71.34 J4.1 | 102.16,71.77 103.92,73.53 104.87,73.53 107.06,71.34 111.54,71.34 J5.1 111.54,71.44 111.54,72.96 112.11,73.53 113.63,73.53 114.78,72.39 120.68,72.39
  Top 0.229: R5A1.2 12.57,53.05 16,53.05 J3.1 16.19,53.05 16.48,53.34 22,53.34 C1B1.- 22.19,53.44 23.43,53.44 | R2A2.1 97.73,11.05 97.73,19.43 98.11,19.81 98.11,21.72 JP11.6 | C5.- 48.96,67.06 51.63,67.06 55.53,70.96 62.49,70.96 JP5.3 | v123.35,53.63 124.11,53.63 X10.4 | v137.35,53.63 138.11,53.63 X12.4 | 18.48,46.29 23.24,46.29 23.43,46.48 23.43,53.44
  Bottom 0.229: v94.77,72.39 93.63,71.25 93.25,71.25 92.97,71.53 92.87,71.44 92.77,71.53 92.68,71.53 92.68,71.63 92.87,71.63 92.87,71.53 93.06,71.34 93.06,70.87 93.16,70.87 93.16,71.15 93.25,71.15 93.25,70.87 93.16,70.77 93.16,70.67 93.06,70.58 92.87,70.58 92.77,70.48 92.87,70.39 92.97,70.39 92.97,70.48 92.87,70.48 92.68,70.29 92.58,70.29 JP9.3
  pour Bottom (isolate 0.61): 0.1,0 170.1,0 170.1,49 170.1,76 96.1,76 0.1,76
  pour Top: 0.1,0 170.1,0 170.1,46 170.1,76 102.1,76 0.1,76
  pour Route2: 0.1,0 170.1,0 170.1,52 170.1,76 66.1,76 0.1,76
  pour Route15: 0.1,0 170.1,0 170.1,53 170.1,76 90.1,76 0.1,76
IN-PUMP-1
  Top 0.229: U1.24 37.24,46.39 37.24,33.34 36.1,32.19 IC2.5
IN-PUMP-2
  Top 0.229: U1.23 35.91,46.39 35.91,34.58 33.53,32.19 IC2.7
IN-PUMP-3
  Top 0.229: U1.22 34.77,46.39 34.77,36.01 32.29,33.53 32.29,29.72 29.72,27.15 IC2.10
IN-PUMP-4
  Top 0.229: U1.21 33.53,46.39 33.53,43.34 34.39,42.48 34.39,39.15 33.34,38.1 32.67,38.1 31.24,36.67 31.24,36.48 29.15,34.38 27.91,34.38 27.15,33.62 27.15,27.15 IC2.12
IN-PUMP-5  (via drill 0.35)
  Top 0.356: v40.86,50.29 38.2,50.29 33.53,54.96 33.53,55.53 U1.8
  Route2 0.356: v40.86,50.29 40.86,50.01 58.68,32.19 IC4.5
IN-PUMP-6  (via drill 0.35)
  Top 0.356: v38.58,51.15 34.77,54.96 34.77,55.53 U1.7
  Route2 0.356: v38.58,51.15 38.77,51.15 56.01,33.91 56.01,32.19 IC4.7
IN-PUMP-7  (via drill 0.35)
  Top 0.356: v64.01,27.43 66.1,29.53 66.1,48.58 68.96,51.44 68.96,53.53 63.44,59.05 48.96,59.05 42.86,52.96 38.01,52.96 36.01,54.96 36.01,55.53 U1.6
  Route2 0.356: v64.01,27.43 62.96,28.48 53.63,28.48 52.29,27.15 IC4.10
IN-PUMP-8  (via drill 0.35)
  Top 0.356: v38.2,54.01 37.34,54.86 37.34,55.53 U1.5 | v43.82,31.34 43.82,27.62 46.67,24.77 47.72,24.77 49.72,26.77 49.72,27.05 IC4.12
  Route2 0.356: v38.2,54.01 38.2,52.01 37.72,51.53 37.72,37.43 v43.82,31.34
IN-PUMP-9  (via drill 0.35)
  Top 0.356: v43.34,55.53 42.39,55.53 U1.1
  Route15 0.356: v43.34,55.53 48.58,55.53 67.15,36.96 67.15,31.53 67.91,30.77 79.82,30.77 81.15,32.1 IC5.5
IN-PUMP-10  (via drill 0.35)
  Top 0.356: v41.15,57.24 41.15,55.63 U1.2
  Route2 0.356: v41.15,57.24 41.15,53.34 60.96,33.53 77.25,33.53 78.58,32.19 IC5.7
IN-PUMP-11  (via drill 0.35)
  Top 0.356: v42.39,53.82 40.96,53.82 39.82,54.96 39.82,55.53 U1.3
  Route15 0.356: v42.39,53.82 49.34,53.82 65.25,37.91 v65.25,34.96 | v66.58,27.91 68.68,27.91 69.25,28.48 73.44,28.48 74.77,27.15 IC5.10
  Bottom 0.356: v65.25,34.96 66.1,34.1 66.1,29.53 65.91,29.34 65.91,28.57 v66.58,27.91
IN-PUMP-12  (via drill 0.35)
  Top 0.356: v39.34,57.15 38.58,56.39 38.58,55.63 U1.4 | v66.96,39.34 66.96,39.05 66.77,38.86 v66.77,28.96
  Route2 0.356: v66.77,28.96 70.49,28.96 72.3,27.15 IC5.12
  Route15 0.356: v39.34,57.15 40.01,57.15 40.77,56.39 49.06,56.39 66.1,39.34 v66.96,39.34
IN-PWM-1  (via drill 0.35)
  Top 0.229: R5A1.1 9.72,52.96 9.72,49.91 R1A1.2 4.76,49.91 3.14,48.29 X1.1 | v95.06,27.24 98.11,24.19 98.11,22.77 99.54,21.34 99.54,20.29 JP11.7
  Route2 0.229: v95.06,27.24 92.87,27.24 85.92,34.2 63.15,34.2 v62.96,34.38
  Route15 0.229: X1.1 3.14,48.2 4.1,47.24 37.34,47.24 42.86,41.72 42.86,41.24 43.91,40.2 44.39,40.2 45.82,38.77 46.86,38.77 JP4.7 46.96,38.77 48.96,38.77 53.44,43.24 55.34,43.24 55.72,42.86 55.72,36.96 59.91,32.77 59.91,31.72 60.68,30.96 61.72,30.96 62.39,31.62 62.39,32.48 62.96,33.05 v62.96,34.38
IN-PWM-2
  Top 0.229: 9.72,45.72 9.72,46.77 R1B1.1 | 9.72,45.72 9.72,43.72 R5B1.1 | 9.72,45.72 3.14,45.72 X1.2
  Route2 0.229: JP11.11 104.59,20.29 103.54,20.29 102.11,21.72 99.16,21.72 98.11,22.77 98.11,23.24 95.35,26 87.82,26 83.63,30.19 51.15,30.19 49.72,31.62 49.72,33.34 44.39,38.67 JP4.5
  Route15 0.229: JP4.5 44.29,38.77 43.24,38.77 41.82,40.2 36.58,40.2 31.05,45.72 3.14,45.72 X1.2
IN-PWM-3
  Top 0.229: R5A2.1 9.72,39.91 9.72,36.96 R1A2.2 9.62,36.86 3.72,36.86 3.14,36.29 X2.1
  Route15 0.229: X2.1 3.14,36.2 3.53,35.81 37.91,35.81 40.77,38.67 41.82,38.67 JP4.3 41.82,38.58 47.15,33.24 47.15,31.72 49.25,29.62 63.72,29.62 67.63,25.72 100.68,25.72 103.54,22.86 104.59,22.86 JP11.12
IN-PWM-4  (via drill 0.35)
  Top 0.229: R5B2.1 9.72,30.77 9.72,33.81 R1B2.1 9.62,33.81 3.14,33.81 X2.2 | v100.87,28.1 105.73,23.24 105.73,22.77 107.16,21.34 107.16,20.29 JP11.13
  Route2 0.229: v100.87,28.1 99.25,28.1 85.63,41.72 54.01,41.72 v52.48,43.24
  Route15 0.229: JP4.1 39.24,38.67 33.81,38.67 33.15,38.01 3.34,38.01 2,36.67 2,34.86 3.05,33.81 X2.2
  Bottom 0.229: v52.48,43.24 50.48,41.24 48.86,41.24 48.39,40.77 47.91,40.77 47.34,40.2 40.77,40.2 39.34,38.77 JP4.1
ISO-1-5V  (via drill 0.35)
  Top 0.229: R14.6 110.49,36.77 109.73,36.77 R14.7 109.73,36.86 v109.73,37.72 | JP13.1 106.49,26 105.25,27.24 105.25,40.96 C11.1 105.35,41.05 105.35,44.39 107.82,46.86 107.82,48.29 110.01,50.48 112.68,50.48 113.82,49.34 113.82,48.77 X8.8
  Route15 0.229: JP13.1 106.59,26 109.73,29.15 v109.73,37.72 109.73,37.81 108.01,39.53 108.01,44.01 106.4,45.62 106.4,60.67 PS1.4
ISO-2-5V  (via drill 0.35)
  Top 0.229: R16.6 126.49,35.81 125.73,35.81 R16.7 125.73,35.91 v125.73,36.77 | C13.1 119.25,39.91 v120.21,38.96 120.21,37.72 124.4,33.53 127.83,33.53 128.4,34.1 128.4,42.77 128.02,43.15 128.02,48.39 X10.8
  Route2 0.229: v120.21,38.96 120.21,53.91 119.35,54.77 119.35,60.67 PS2.4
  Route15 0.229: JP15.1 121.64,26 125.73,30.1 v125.73,36.77 125.64,36.77 123.45,38.96 v120.21,38.96
ISO-3-5V  (via drill 0.35)
  Top 0.229: R18.6 139.45,35.81 138.78,35.81 R18.7 138.78,35.91 v138.78,36.77 | JP17.1 136.49,26 133.26,29.24 133.26,39.91 C15.1 133.26,40.1 133.26,42.29 137.45,46.48 137.45,49.44 138.21,50.2 140.78,50.2 141.92,49.05 141.92,48.48 X12.8
  Route15 0.229: JP17.1 136.59,26 138.78,28.19 v138.78,36.77 138.78,36.86 132.4,43.24 132.4,60.67 PS3.4
ISO-4-5V  (via drill 0.35)
  Top 0.229: R21.6 154.4,35.81 153.73,35.81 R21.7 153.73,35.91 v153.73,36.77 | JP19.1 151.54,26 147.26,30.29 147.26,39.91 C17.1 147.26,40.1 147.26,44.29 153.16,50.2 155.73,50.2 | 155.73,50.2 156.97,48.96 156.97,48.48 X15.8 | PS4.4 145.35,60.77 146.4,60.77 147.54,61.91 153.73,61.91 157.74,57.91 157.74,52.29 155.73,50.29 155.73,50.2
  Route15 0.229: v153.73,36.77 153.73,28.1 151.64,26 JP19.1
ISO-GND-1
  Top 0.229: C11.2 106.87,41.05 106.87,43.62 106.59,43.91 JP12.3 106.59,44.1 110.01,47.53 110.01,48.67 X8.5
  Route2 0.229: PS1.3 108.78,60.67 108.78,54.01 106.59,51.82 106.59,44.01 JP12.3
ISO-GND-2
  Top 0.229: C13.2 120.97,40.01 120.97,43.34 121.54,43.91 JP14.3 121.54,44.1 124.11,46.67 124.11,48.39 X10.5
  Route2 0.229: PS2.3 121.83,60.67 121.83,44.2 121.64,44.01 JP14.3
ISO-GND-3
  Top 0.229: C15.2 134.97,40.01 134.97,42.39 136.49,43.91 JP16.3 136.59,44.1 138.11,45.62 138.11,48.39 X12.5
  Route15 0.229: PS3.3 134.88,60.67 134.88,45.62 136.49,44.01 JP16.3
ISO-GND-4
  Top 0.229: C17.2 148.97,40.01 148.97,41.34 151.54,43.91 JP18.3 151.54,44.1 153.16,45.72 153.16,48.39 X15.5
  Route15 0.229: PS4.3 147.92,60.67 147.92,47.62 151.54,44.01 JP18.3
ISO-PRB-1+
  Route2 0.229: JP13.2 109.16,26 110.11,26 137.07,52.96 156.78,52.96 162.78,58.96 165.07,58.96 X18.1
ISO-PRB-1GND
  Route2 0.229: JP13.3 111.73,26 117.06,26 142.4,51.34 157.45,51.34 162.5,56.39 X18.5
  Route15 0.229: X18.4 167.64,56.48 167.64,61.44 X18.3 167.64,61.53 162.59,61.53 X18.2 162.59,61.44 162.59,56.48 X18.5
ISO-PRB-2+
  Route2 0.229: JP15.2 124.11,26 125.16,26 144.21,45.05 165.07,45.05 X19.1
ISO-PRB-2GND
  Route2 0.229: JP15.3 126.68,26 135.07,26 151.45,42.39 162.5,42.39 X19.5
  Route15 0.229: X19.4 167.64,42.48 167.64,47.43 X19.3 167.64,47.53 162.59,47.53 X19.2 162.59,47.43 162.59,42.48 X19.5
ISO-PRB-3+
  Route2 0.229: JP17.2 139.16,26 140.11,26 145.07,30.96 165.07,30.96 X20.1
ISO-PRB-3GND
  Route2 0.229: JP17.3 150.02,26 152.4,28.38 162.5,28.38 X20.5
  Route15 0.229: X20.4 167.64,28.48 167.64,33.43 X20.3 167.64,33.53 162.59,33.53 X20.2 162.59,33.43 162.59,28.48 X20.5
ISO-PRB-4+
  Route2 0.229: JP19.2 154.12,25.91 154.88,25.91 162.78,18 165.07,18 X21.1
ISO-PRB-4GND
  Top 0.229: JP19.3 156.69,25.91 157.16,25.91 162.5,20.57 X21.2
  Route15 0.229: X21.4 167.74,15.53 167.74,20.48 X21.3 167.64,19.24 162.69,19.24 X21.2 162.59,20.48 162.59,15.53 X21.5
LED1
  Top 0.229: R7.1 46.77,52.2 44.01,52.2 38.58,46.77 38.58,46.48 U1.25 38.58,46.29 39.24,45.62 39.24,41.34 JP4.2
LED2
  Top 0.229: R7.2 47.63,52.2 47.63,51.91 45.82,50.1 43.15,50.1 39.82,46.77 39.82,46.48 U1.26 39.82,46.29 39.82,46.01 41.82,44.01 41.82,41.34 JP4.4
LED3
  Top 0.229: R7.3 48.48,52.2 48.48,52.01 46.2,49.72 43.72,49.72 41.15,47.15 41.15,46.48 U1.27 41.05,46.29 41.05,46.1 44.29,42.86 44.29,41.34 JP4.6
LED4
  Top 0.229: R7.4 49.34,52.2 49.34,52.01 46.67,49.34 43.91,49.34 42.39,47.82 42.39,46.48 U1.28 42.39,46.29 46.86,41.81 46.86,41.34 JP4.8
N$1
  Top 0.229: R9.2 59.15,37.15 59.15,36.77 63.72,32.19 IC4.1
N$2
  Top 0.229: R8.2 56.58,37.15 53.91,37.15 51.15,34.38 48.1,34.38 45.91,32.19 IC4.15
N$3
  Top 0.229: R11.2 88.11,37.15 88.11,34 86.3,32.19 IC5.1
N$4
  Top 0.229: R10.2 80.01,37.15 77.34,37.15 74.58,34.38 70.68,34.38 68.49,32.19 IC5.15
N$5
  Top 0.229: D11.A 40.01,72.96 40.01,67.06 37.15,64.2 36.2,64.2 35.05,63.06 R3.1 35.15,62.96 36.01,62.1 36.01,60.01 R5.2 36.2,59.91 38.67,59.91 39.72,58.86 IC3.1 39.82,58.86 43.63,62.67 60.68,62.67 69.53,53.82 69.53,51.15 69.25,50.86 69.25,45.34 70.01,44.58 70.01,43.62 C8.+
N$6
  Top 0.229: 57.15,3.52 58.39,2.29 U2.6 | 57.15,3.52 54.1,3.52 R2A1.2 | R3-1A1.1 94.58,46.96 94.97,46.96 100.59,41.34 100.59,40.67 96.2,36.29 93.63,36.29 92.3,34.96 92.3,29.62 89.35,26.67 89.25,26.67 86.3,23.72 84.96,23.72 74.77,13.53 74.77,11.81 74.68,11.72 72.01,11.72 69.44,14.29 67.53,14.29 66.77,13.53 66.77,11.81 66.68,11.72 63.63,11.72 60.39,8.48 60.39,6.86 57.15,3.62 57.15,3.52
N$7
  Top 0.229: R7.8 46.86,53.82 46.86,55.53 49.06,57.72 LED1.A
N$8
  Top 0.229: U2.2 59.82,7.81 59.82,10.29 60.49,10.95 R2B1.1 60.58,11.05 61.34,11.05 73.53,23.24 79.92,23.24 81.54,24.86 85.44,24.86 87.54,26.96 87.54,31.91 94.49,38.86 94.49,40.96 R3-1B1.1
N$9  (via drill 0.35)
  Top 0.229: v21.53,26.38 17.53,22.38 17.53,7.53 19.34,5.71 19.34,3.05 R1.2
  Route2 0.229: v21.53,26.38 21.81,26.38 27.15,31.72 27.15,32.67 27.91,33.43 39.82,33.43 41.05,32.19 IC2.1
N$10
  Top 0.229: R6.2 39.72,9.05 39.72,11.91 25.81,25.81 25.81,29.62 23.34,32.1 IC2.15
N$11
  Top 0.229: IC1.1 20.86,57.91 23.91,60.96 28,60.96 R4.2 28.2,61.05 29.81,62.67 29.81,66.67 32.01,68.87 R2.1 32.1,68.77 37.15,68.77 | 37.15,68.77 37.24,68.77 38.48,67.53 C4.+ | 37.15,68.77 37.15,72.96 D1.A
N$13
  Top 0.229: R7.7 47.72,53.82 47.72,54.01 49.25,55.53 49.82,55.53 52.01,57.72 LED2.A
N$17
  Top 0.229: R3-2B1.1 73.72,13.05 84.77,24.1 86.11,24.1 89.92,27.91 90.01,27.91 91.92,29.81 91.92,35.72 97.16,40.96 R3-1B1.2 97.25,40.96 99.63,40.96 R3-1B1.3
N$18
  Top 0.229: R3-3B1.1 76.49,12.95 R3-2B1.2
N$19  (via drill 0.35)
  Top 0.229: v89.73,28.57 85.63,24.48 84.58,24.48 82.96,22.86 75.53,22.86 65.72,13.05 R3-2A1.1
  Route15 0.229: v89.73,28.57 89.73,39.62 97.06,46.96 R3-1A1.2 97.16,47.05 99.63,47.05 R3-1A1.3
N$20
  Top 0.229: R3-3A1.1 68.49,10 68.49,12.95 R3-2A1.2
N$21
  Top 0.229: R1A1.1 12.76,49.91 15.62,47.05 C1A1.+ 15.72,46.96 15.72,42.01 R4A2.1
N$22
  Top 0.229: R1B1.2 12.48,46.86 12.48,47.72 11.34,48.86 11.34,50.96 11.62,51.24 21.34,51.24 22,50.58 C1B1.+ 22.1,50.48 22.1,47.43 R4B1.1
N$23
  Top 0.229: R22.8 149.73,19.81 148.5,19.81 146.11,22.19 LED13.A
N$24
  Top 0.229: R22.7 150.69,19.81 150.69,20.67 149.16,22.19 LED14.A
N$25
  Top 0.229: U2.5 57.15,2.19 36.67,2.19 36.2,1.71 17.72,1.71 17.15,2.29 17.15,23.81 20,26.67 20,40.48 18.58,41.91 R4A2.2
N$26  (via drill 0.35)
  Top 0.229: v38.2,35.15 39.82,33.53 39.82,30.67 46.29,24.19 46.77,24.19 58.77,12.19 58.77,9.81 58.48,9.53 58.48,7.81 U2.3 | v23.43,43.24 22.1,44.58 R4B1.2
  Route2 0.229: v38.2,35.15 33.34,35.15 30.1,38.39 29.62,38.39 27.15,40.86 25.81,40.86 v23.43,43.24
N$27
  Top 0.229: R3-2B2.1 89.73,13.05 89.73,22.86 94.97,28.1 96.2,28.1 97.06,28.96 R3-1B2.2
  Route15 0.229: R3-1B2.3 99.63,29.05 97.16,29.05 R3-1B2.2
N$28
  Top 0.229: R22.6 151.54,19.81 151.54,20.67 153.07,22.19 LED15.A
N$29
  Top 0.229: R22.5 152.4,19.81 154.69,19.81 157.07,22.19 LED16.A
N$30
  Top 0.229: R15.5 118.4,19.81 119.64,19.81 122.02,22.19 LED8.A
N$39
  Top 0.229: R15.6 117.54,19.81 117.54,20.67 119.06,22.19 LED7.A
N$41
  Top 0.229: LED6.A 116.11,22.19 116.11,20.57 116.68,20 116.68,19.81 R15.7
N$43
  Top 0.229: R15.8 115.73,19.81 115.54,19.81 113.16,22.19 LED5.A
N$44
  Top 0.229: R19.8 132.78,19.81 131.54,19.81 129.16,22.19 LED9.A
N$45
  Top 0.229: LED10.A 132.11,22.19 132.11,21.62 133.64,20.1 133.64,19.81 R19.7
N$46
  Top 0.229: R19.6 134.59,19.81 134.59,21.72 135.07,22.19 LED11.A
N$47
  Top 0.229: R19.5 135.45,19.81 135.64,19.81 138.02,22.19 LED12.A
N$48
  Top 0.229: R7.6 48.58,53.72 48.58,53.44 48.96,53.05 50.39,53.05 55.06,57.72 LED3.A
N$49  (via drill 0.35)
  Top 0.229: v51.15,55.53 49.44,53.82 R7.5 | v57.25,56.96 58.01,57.72 LED4.A
  Route2 0.229: v51.15,55.53 55.82,55.53 v57.25,56.96
N$50
  Top 0.229: R3-3B2.1 92.49,12.95 R3-2B2.2
N$51
  Top 0.229: R3-2A2.1 81.73,13.05 81.73,19.05 86.01,23.34 86.49,23.34 89.44,26.29 89.54,26.29 93.63,30.39 93.63,35.72 93.82,35.91 96.2,35.91 97.06,35.05 R3-1A2.2
  Route15 0.229: R3-1A2.3 99.63,35.05 97.16,35.05 R3-1A2.2
N$52
  Top 0.229: R3-3A2.1 84.49,12.95 R3-2A2.2
N$53
  Top 0.229: R4A1.1 9.72,27.05 9.72,28.57 11.34,30.19 11.34,35.72 12.48,36.86 R1A2.1 12.57,36.96 15.62,36.96 C1A2.+
N$54
  Top 0.229: R4B2.1 18.48,28 18.48,29.15 15.72,31.91 C1B2.+ 15.62,32.1 13.91,33.81 12.57,33.81 R1B2.2
N$55
  Top 0.229: U3.6 99.82,7.81 99.82,10.29 100.49,10.95 R2A2.2 100.59,11.05 100.68,11.14 100.68,23.15 98.78,25.05 98.78,28.57 94.58,32.77 94.58,34.96 R3-1A2.1
N$56  (via drill 0.35)
  Top 0.229: 101.63,4 103.63,4 104.01,3.62 R2B2.1 | 101.63,4 99.44,4 98.49,3.05 98.49,2.29 U3.2 | v99.44,26.96 99.44,24.96 101.06,23.34 101.06,12.67 101.63,12.1 101.63,4
  Route2 0.229: v99.44,26.96 97.82,26.96 95.82,28.96 94.58,28.96 R3-1B2.1
N$57  (via drill 0.35)
  Top 0.229: v90.58,4.86 98.11,4.86 100.97,7.71 U3.5 | v13.81,25.72 12.57,26.96 R4A1.2
  Route2 0.229: v90.58,4.86 38.48,4.86 24.77,18.57 20.96,18.57 v13.81,25.72
N$58  (via drill 0.35)
  Top 0.229: v99.73,3.33 99.73,2.29 U3.3 | v17.91,25.72 15.72,27.91 R4B2.2
  Route2 0.229: v99.73,3.33 93.54,3.33 91.35,5.52 41.72,5.52 21.53,25.72 v17.91,25.72
N$74
  Top 0.229: U1.15 25.81,46.39 25.81,40.77 27.05,39.53 JP1.2
N$75
  Top 0.229: U1.16 27.15,46.39 27.15,43.72 28.86,42.01 28.86,40.67 30.01,39.53 JP2.2
N$76
  Top 0.229: U1.17 28.39,46.48 28.39,46.86 29.24,47.72 31.24,47.72 31.62,47.34 31.62,40.96 33.05,39.53 JP3.2
NISO-PRB-1+
  Route15 0.229: X11.2 141.35,72.01 140.88,72.01 139.45,73.44 131.16,73.44 120.02,62.29 74.39,62.29 65.15,53.05 JP6.2
NISO-PRB-1GND
  Route15 0.229: X11.1 138.78,71.91 130.21,71.91 120.21,61.91 76.58,61.91 67.72,53.05 JP6.3
NISO-PRB-2+
  Route2 0.229: X14.2 149.35,71.91 148.21,71.91 144.88,68.58 128.78,68.58 122.11,61.91 105.06,61.91 96.2,53.05 96.2,52.58 95.44,51.82 81.25,51.82 80.11,52.96 JP8.2
NISO-PRB-2GND
  Top 0.229: X14.1 146.78,71.91 143.54,71.91 133.92,62.29 91.92,62.29 82.68,53.05 JP8.3
NISO-PRB-3+
  Route2 0.229: X17.2 157.35,72.01 156.31,72.01 155.26,73.06 132.68,73.06 121.92,62.29 104.4,62.29 95.16,53.05 JP10.2
NISO-PRB-3GND
  Top 0.229: X17.1 154.78,71.91 151.54,71.91 141.54,61.91 117.06,61.91 110.87,55.72 106.49,55.72 103.82,53.05 97.73,53.05 JP10.3
OUT-PUMP-1
  Top 0.356: R15.1 115.73,18.19 115.73,17.24 112.68,14.19 112.68,11.43 X9.1 | D4.C 28.1,3.05 30.96,3.05 D3.A 31.15,3.14 32.86,3.14 34.29,4.57 37.91,4.57 41.05,7.71 41.53,7.71 41.82,8 41.82,17.14 38.96,20 38.96,26.19 39.82,27.05 IC2.2
  Route15 0.356: X9.1 112.59,11.43 58.68,11.43 43.05,27.05 39.91,27.05 IC2.2
OUT-PUMP-2  (via drill 0.36)
  Top 0.356: R15.2 116.68,18.19 116.68,15.81 115.25,14.38 115.25,11.43 X9.3 | D5.A 30.96,6 28.1,6 D6.C 27.91,6.1 v27.91,7.43
  Route2 0.356: X9.3 115.16,11.43 114.11,11.43 110.68,14.86 78.3,14.86 63.44,29.72 40.96,29.72 38.58,32.1 IC2.3
  Route15 0.356: v27.91,7.43 27.91,22 23.34,26.57 23.34,30.39 24.58,31.62 24.58,32.67 25.43,33.53 37.15,33.53 38.48,32.19 IC2.3
OUT-PUMP-3
  Top 0.356: R15.3 117.54,18.19 117.54,14.48 117.73,14.29 117.73,11.43 X9.5 | D7.A 30.96,9.05 28.1,9.05 D8.C 28,9.14 28,9.81 25.24,12.57 25.24,23.72 22.1,26.86 22.1,33.62 22.77,34.29 23.91,34.29 25.81,32.38 25.81,32.19 IC2.13
  Route15 0.356: X9.5 117.73,11.43 117.25,11.43 114.97,13.72 114.97,14.38 107.73,21.62 90.01,21.62 86.39,25.24 67.44,25.24 63.53,29.15 43.72,29.15 42.1,30.77 27.24,30.77 25.91,32.1 IC2.13
OUT-PUMP-4  (via drill 0.36)
  Top 0.356: R15.4 118.4,18.19 118.4,16 120.21,14.19 120.21,11.43 X9.7 | D9.A 30.96,12 28.1,12 D10.C 27.91,12.1 27.91,23.05 24.67,26.29 24.67,27.05 IC2.14
  Route2 0.356: v83.15,10.29 118.21,10.29 119.25,11.34 120.21,11.34 X9.7
  Route15 0.356: v83.15,10.29 41.44,10.29 24.67,27.05 IC2.14
OUT-PUMP-5  (via drill 0.36)
  Top 0.356: R19.1 132.78,18.19 132.78,14.86 132.02,14.1 132.02,13.43 130.02,11.43 129.73,11.43 X13.1 | D13.A 58.96,50.01 D17.C 59.15,49.91 59.15,49.15 60.49,47.82 v60.49,40.48 | v63.15,35.34 64.96,33.53 64.96,29.62 62.49,27.15 IC4.2
  Route2 0.356: v60.49,40.48 60.49,38.01 v63.15,35.34 | X13.1 129.64,11.34 121.73,11.34 119.92,9.53 82.87,9.53 65.82,26.57 62.96,26.57 62.49,27.05 IC4.2
OUT-PUMP-6  (via drill 0.36)
  Top 0.356: R19.2 133.73,18.19 133.73,15.24 134.68,14.29 134.68,13.43 132.68,11.43 132.21,11.43 X13.3 132.02,11.34 131.16,11.34 130.11,10.29 129.16,10.29 122.87,16.57 122.87,24.29 122.4,24.77 117.25,24.77 v112.3,29.72 | 57.15,46.96 58.96,46.96 D18.C | 57.15,46.96 55.06,46.96 D14.A | v57.15,44.77 57.15,46.96
  Route2 0.356: v112.3,29.72 97.25,44.77 v57.15,44.77
  Route15 0.356: v57.15,44.77 57.15,36.2 61.15,32.19 IC4.3
OUT-PUMP-7  (via drill 0.36)
  Top 0.356: v134.49,17.24 134.49,18.19 R19.3 | D19.C 58.96,44.01 D15.A 55.06,43.81 v55.06,42.58
  Route15 0.356: v134.49,17.24 134.49,16.57 132.3,14.38 | 132.3,14.38 132.3,13.43 134.3,11.43 134.68,11.43 X13.5 | v55.06,42.58 55.06,38.77 48.48,32.19 IC4.13 48.86,32.38 51.15,30.1 83.82,30.1 87.73,26.19 100.87,26.19 102.2,24.86 121.45,24.86 131.83,14.48 132.21,14.48 132.3,14.38
OUT-PUMP-8
  Top 0.356: R19.4 135.45,18.19 135.45,16 137.26,14.19 137.26,11.43 X13.7 | D20.C 58.96,40.96 55.06,40.96 D16.A 54.96,40.86 53.25,40.86 51.53,39.15 49.91,39.15 44.67,33.91 44.67,29.62 47.15,27.15 IC4.14
  Route15 0.356: X13.7 137.26,11.34 136.49,10.57 136.49,10.48 135.45,9.43 115.63,9.43 113.73,11.34 113.73,11.81 110.68,14.86 59.44,14.86 47.25,27.05 IC4.14
OUT-PUMP-9  (via drill 0.36)
  Top 0.356: v149.73,16.86 149.73,18.19 R22.1 | D21.A 78.11,50.01 82.01,50.01 D22.C 82.2,50.01 83.92,50.01 85.15,51.24 87.15,51.24 87.44,50.96 87.44,39.43 85.06,37.05 85.06,27.15 IC5.2
  Route2 0.356: v149.73,16.86 149.73,14.86 149.26,14.38 149.26,12.76 150.31,11.72 150.31,10.95 149.64,10.29 147.73,10.29 146.69,11.34 X16.1 146.5,11.43 142.5,11.43 134.88,19.05 99.16,19.05 98.2,20 98.2,20.67 97.25,21.62 90.49,21.62 85.06,27.05 IC5.2
OUT-PUMP-10
  Top 0.356: R22.2 150.69,18.19 150.69,15.81 149.26,14.38 149.26,11.43 X16.3 | 79.92,46.96 82.01,46.96 D24.C | 79.92,46.96 78.11,46.96 D23.A | 79.92,46.96 79.92,40.39 81.34,38.96 81.34,34.86 83.73,32.48 83.73,32.19 IC5.3
  Route2 0.356: X16.3 149.16,11.43 148.11,11.43 135.07,24.48 97.54,24.48 95.54,26.48 89.44,26.48 83.82,32.1 IC5.3
OUT-PUMP-11  (via drill 0.36)
  Top 0.356: R22.3 151.54,18.19 151.54,14.48 151.64,14.38 151.64,11.43 X16.5 151.54,11.34 150.69,11.34 149.64,10.29 148.78,10.29 147.73,11.34 147.73,12.57 138.88,21.43 138.88,24.29 138.4,24.77 129.54,24.77 123.83,30.48 111.92,30.48 107.73,26.29 107.73,25.43 107.06,24.77 106.11,24.77 101.06,29.81 101.06,41.62 95.54,47.15 95.54,47.72 91.44,51.82 78.2,51.82 77.63,51.24 77.06,51.24 76.77,50.96 76.77,48.2 76.87,48.1 | 76.87,48.1 76.96,48.2 83.15,48.2 83.35,48.01 83.35,45.24 82.11,44.01 D26.C | 76.87,48.1 76.77,48.01 76.77,46.01 78.01,44.77 78.01,44.01 D25.A 77.92,43.91 76.77,42.77 76.77,41.43 v74.68,39.34
  Route15 0.356: v74.68,39.34 71.06,35.72 71.06,32.19 IC5.13
OUT-PUMP-12  (via drill 0.35)
  Top 0.229: R22.4 152.4,18.19 152.4,15.91 154.21,14.1 154.21,11.43 X16.7 | v79.15,42.39 78.11,41.34 78.11,41.05 D27.A | v80.68,42.39 82.01,41.05 D28.C | v71.15,42.39 67.34,38.58 67.34,29.53 69.72,27.15 IC5.14
  Route2 0.229: v71.15,42.39 v79.15,42.39 v80.68,42.39 80.77,42.39 81.54,43.15 87.73,43.15 95.44,35.43 95.44,35.34 105.82,24.96 142.59,24.96 151.54,16 151.54,13.91 154.02,11.43 154.21,11.43 X16.7
PWM-OUT-1
  Top 0.229: U2.7 59.82,2.19 59.82,1.91 60.58,1.14 64.01,1.14 65.82,2.95 X4.1 65.72,3.05 65.72,9.91 R3-3A1.2
PWM-OUT-2
  Top 0.229: 72.39,8.67 67.63,8.67 67.34,8.95 67.34,10.57 66.58,11.34 64.77,11.34 61.25,7.81 61.06,7.81 U2.1 | 72.39,8.67 73.63,9.91 R3-3B1.2 | X5.1 73.82,3.05 73.82,7.14 72.39,8.57 72.39,8.67
PWM-OUT-3
  Top 0.229: 82.96,8.67 85.35,8.67 88.01,11.34 90.58,11.34 90.77,11.14 90.77,9.53 93.54,6.76 97.63,6.76 98.39,7.53 98.39,7.71 U3.7 | 82.96,8.67 81.73,9.91 R3-3A2.2 | X6.1 81.92,3.05 81.92,7.53 82.96,8.57 82.96,8.67
PWM-OUT-4
  Top 0.229: U3.1 97.16,2.19 93.82,2.19 92.77,1.14 91.73,1.14 89.92,2.95 X7.1 89.73,3.05 89.73,9.91 R3-3B2.2
SCL  (via drill 0.35)
  Top 0.229: U1.12 28.29,55.53 28.29,55.15 27.53,54.39 23.62,54.39 21.43,56.58 17.53,56.58 16.1,58.01 J3.3 | X15.3 154.4,53.63 154.4,54.2 153.54,55.05 149.73,55.05 147.73,53.05 147.73,52.77 R20.3 147.64,53.05 145.54,55.15 140.5,55.15 139.54,54.2 139.54,53.63 X12.3 139.45,54.2 138.11,55.53 126.68,55.53 125.45,54.29 X10.3 | v129.35,52.01 132.21,52.01 132.68,52.48 132.68,52.67 R17.3 | v125.92,51.91 125.92,53.15 125.54,53.53 X10.3 | R12.3 105.73,52.77 105.73,53.05 108.01,55.34 110.49,55.34 111.35,54.48 111.35,53.91 X8.3 111.44,53.82 111.44,53.24 112.21,52.48 112.49,52.48 112.97,52.01 118.21,52.01 118.68,52.48 118.68,52.67 R13.3 118.68,52.86 118.68,53.91 119.83,55.05 124.59,55.05 125.35,54.29 125.35,53.63 X10.3 | 129.07,70.1 124.21,70.1 123.64,70.67 J6.4 123.54,71.25 123.54,70.67 122.97,70.1 115.35,70.1 114.68,70.77 J5.4 114.59,71.25 114.59,70.77 113.92,70.1 107.73,70.1 106.59,71.25 105.63,71.25 J4.4 105.63,71.15 105.63,70.77 104.3,69.44 84.2,69.44 82.68,70.96 JP7.1 | 129.07,70.1 131.92,70.1 132.59,70.77 132.59,71.25 J7.4 | 129.07,70.1 v129.07,67.91
  Route2 0.229: X3.1 3.14,24.29 3.14,32.29 14.96,44.1 14.96,56.96 16,58.01 J3.3 | X13.8 138.49,13.81 137.45,12.76 130.59,12.76 129.54,13.81 121.64,13.81 X9.8 121.45,13.91 120.02,15.34 102.2,15.34 97.35,20.19 97.06,20.19 JP11.5 | v125.92,51.91 126.02,52.01 v129.35,52.01 129.07,52.1 v129.07,67.91 | JP5.1 67.72,70.96 76.11,70.96 77.15,69.91 81.54,69.91 82.58,70.96 JP7.1 82.68,70.96 83.73,69.91 95.54,69.91 96.58,70.96 97.63,70.96 JP9.1
  Route15 0.229: 20.1,66.96 20.1,62.1 16.1,58.1 J3.3 | 20.1,66.96 20.1,67.91 J2.3 | 151.54,12.76 139.64,12.76 138.59,13.81 X13.8 | 151.54,12.76 153.26,12.76 154.31,13.81 155.45,13.81 X16.8 | 151.54,12.76 151.54,14.38 149.73,16.19 144.88,16.19 129.35,31.72 v129.35,52.01 | 20.1,66.96 51.53,66.96 54.48,69.91 66.58,69.91 67.63,70.96 JP5.1
SCL2
  Top 0.229: R14.3 110.59,35.34 110.59,35.62 110.97,36.01 111.82,36.01 112.02,36.2 112.02,43.62 111.73,43.91 JP12.1 111.63,44.1 111.44,44.29 111.44,48.67 X8.6
SCL3
  Top 0.229: R16.3 126.59,34.29 126.59,34.58 127.06,35.05 127.83,35.05 128.02,35.24 128.02,42.58 126.68,43.91 JP14.1 126.59,44.1 125.54,45.15 125.54,48.39 X10.6
SCL4
  Top 0.229: R18.3 139.54,34.29 139.54,34.58 140.02,35.05 140.88,35.05 141.54,35.72 141.54,43.91 JP16.1 141.64,44.1 139.54,46.2 139.54,48.39 X12.6
SCL5
  Top 0.229: R21.3 154.5,34.29 154.5,34.48 155.07,35.05 155.83,35.05 156.59,35.81 156.59,43.91 JP18.1 156.59,44.1 154.5,46.2 154.5,48.39 X15.6
SDA  (via drill 0.35)
  Top 0.229: 14.86,57.53 15.53,56.86 16.67,56.86 17.34,56.2 21.24,56.2 23.43,54.01 28.39,54.01 28.96,54.58 28.96,56.67 28.77,56.86 28,56.86 27.15,56.01 27.15,55.63 U1.13 | 14.86,57.53 14.86,59.44 16,60.58 J3.4 16.19,60.67 22.67,67.15 22.67,67.91 J2.4 | X3.2 3.05,21.81 3.05,22.1 1.24,23.91 1.24,36.67 6.95,42.39 10.57,42.39 10.95,42.77 10.95,53.72 14.76,57.53 14.86,57.53 | 134.73,12.81 135.73,13.81 135.92,13.81 X13.6 | 134.73,12.81 133.73,11.81 133.73,11.43 132.11,9.81 120.4,9.81 119.06,11.14 119.06,13.81 X9.6 | 134.73,12.81 135.73,11.81 135.73,11.43 137.35,9.81 151.64,9.81 152.97,11.14 152.97,13.81 X16.6 | v150.69,52.01 148.97,52.01 148.59,52.39 148.59,52.67 R20.2 | v153.83,52.01 154.69,52.01 155.64,52.96 155.64,53.53 X15.2 | 139.88,52.15 140.69,52.96 140.69,53.53 X12.2 | 139.88,52.15 139.73,52.01 134.02,52.01 133.54,52.48 133.54,52.67 R17.2 133.45,52.77 133.45,53.05 131.35,55.15 127.54,55.15 126.78,54.39 126.78,53.63 X10.2 126.68,53.53 126.68,51.72 126.21,51.24 125.64,51.24 124.87,52.01 120.02,52.01 119.54,52.48 119.54,52.67 R13.2 119.44,52.77 v119.44,53.72 | v109.16,53.44 106.97,53.44 106.59,53.05 106.59,52.77 R12.2 | v111.63,55.53 112.59,54.58 112.59,53.91 X8.2 | 139.88,52.15 v140.02,52.01 | J4.3 104.59,71.25 104.59,70.58 103.82,69.82 96.3,69.82 95.16,70.96 JP9.2 | v113.54,72.68 113.54,71.34 J5.3 | v122.68,72.68 122.68,71.34 J6.3 | v131.35,72.68 131.54,72.48 131.54,71.34 J7.3
  Route2 0.229: v153.83,52.01 v150.69,52.01 v140.02,52.01 | v109.16,53.44 109.54,53.44 v111.63,55.53 117.63,55.53 v119.44,53.72 | JP9.2 95.16,71.06 96.2,72.1 98.01,72.1 98.11,72.01 112.87,72.01 v113.54,72.68 113.63,72.68 114.3,72.01 122.02,72.01 v122.68,72.68 122.78,72.68 123.16,72.3 130.02,72.3 130.4,72.68 v131.35,72.68
  Route15 0.229: JP11.3 94.58,20.19 95.63,20.19 100.49,15.34 111.06,15.34 114.02,12.38 115.54,12.38 116.68,11.24 116.68,10.95 117.35,10.29 118.11,10.29 118.97,11.14 118.97,13.81 X9.6 | JP9.2 95.06,70.96 94.01,69.91 82.2,69.91 81.15,70.96 80.2,70.96 JP7.2 80.01,71.06 78.96,72.1 67.25,72.1 66.2,71.06 65.15,71.06 JP5.2 65.06,71.06 64.01,72.1 56.1,72.1 52.01,68.01 22.77,68.01 J2.4 | v140.02,52.01 140.02,59.34 140.97,60.29 140.97,70.87 139.92,71.91 139.92,72.39 139.26,73.06 131.73,73.06 v131.35,72.68 | v153.83,52.01 155.16,50.67 155.16,28.96 152.97,26.77 152.97,13.91 X16.6
SDA2
  Top 0.229: R14.2 109.63,35.34 109.63,35.53 109.16,36.01 108.4,36.01 108.11,36.29 108.11,42.96 109.06,43.91 JP12.2 109.06,44.1 110.68,45.72 110.68,49.82 110.97,50.1 111.73,50.1 112.59,49.24 112.59,48.77 X8.7
SDA3
  Top 0.229: R16.2 125.64,34.29 125.64,34.58 125.16,35.05 124.3,35.05 124.11,35.24 124.11,43.91 JP14.2 124.11,44.1 124.78,44.77 124.78,49.53 125.06,49.82 125.83,49.82 126.68,48.96 126.68,48.48 X10.7
SDA4
  Top 0.229: R18.2 138.69,34.29 138.69,34.48 138.11,35.05 137.35,35.05 137.16,35.24 137.16,42.01 139.07,43.91 JP16.2 139.07,44.1 138.88,44.29 138.88,49.62 139.07,49.82 139.83,49.82 140.69,48.96 140.69,48.48 X12.7
SDA5
  Top 0.229: R21.2 153.64,34.29 153.64,34.58 153.16,35.05 152.31,35.05 152.12,35.24 152.12,42.01 154.02,43.91 JP18.2 154.12,44.1 153.83,44.39 153.83,49.62 154.02,49.82 154.88,49.82 155.64,49.05 155.64,48.48 X15.7

## Text on the board
tPlace: ⏚ | ⏚ | ⏚ | Sensor | NISO-3 | 5v | GND | SCL | SDA | Non-Isolated Ezo Connector | SDA | 1 | 2 | 3 | 4 | ISO-1 | SCL | 5v | Screen | 1 | 2 | 3 | GND | PWM 1 | ISO-2 | PWM Input Select | PWM 2 | VCC | PWM 3 | I²C select | GND | Isolated Ezo Connectors | ISO-3 | PWM 4 | SCL | 1 | 2 | 3 | 4 | 1 | 2 | 3 | 4 | 5 | 6 | 7 | 8 | 9 | 10 | 11 | SDA | RPI Connector | ISO-4 | Drone 1 | Drone 2 | Drone 3 | ⏚ | ⏚ | ⏚ | HiveBoard v1.0 | GND/5v/SDA/SCL / P1/P2/P3/P4 | GND/5v/SDA/SCL / P1/P2/P3/P4 | GND/5v/SDA/SCL / P1/P2/P3/P4 | PWM1 Out | PWM2 Out | PWM3 Out | PWM4 Out | ⏚ | ⏚ | ⏚ | ⏚
bPlace: RPI Connector | ⏚ | ⏚ | 1 | ⏚ | SDA | SCL | ⏚ | ⏚ | ⏚ | SCL/SDA/5v/GND / P4/P3/P2/P1 | SCL/SDA/5v/GND / P4/P3/P2/P1 | SCL/SDA/5v/GND / P4/P3/P2/P1